# EAGLE design ibr_node (EAGLE 5.11)

## Sheet 1 of 3
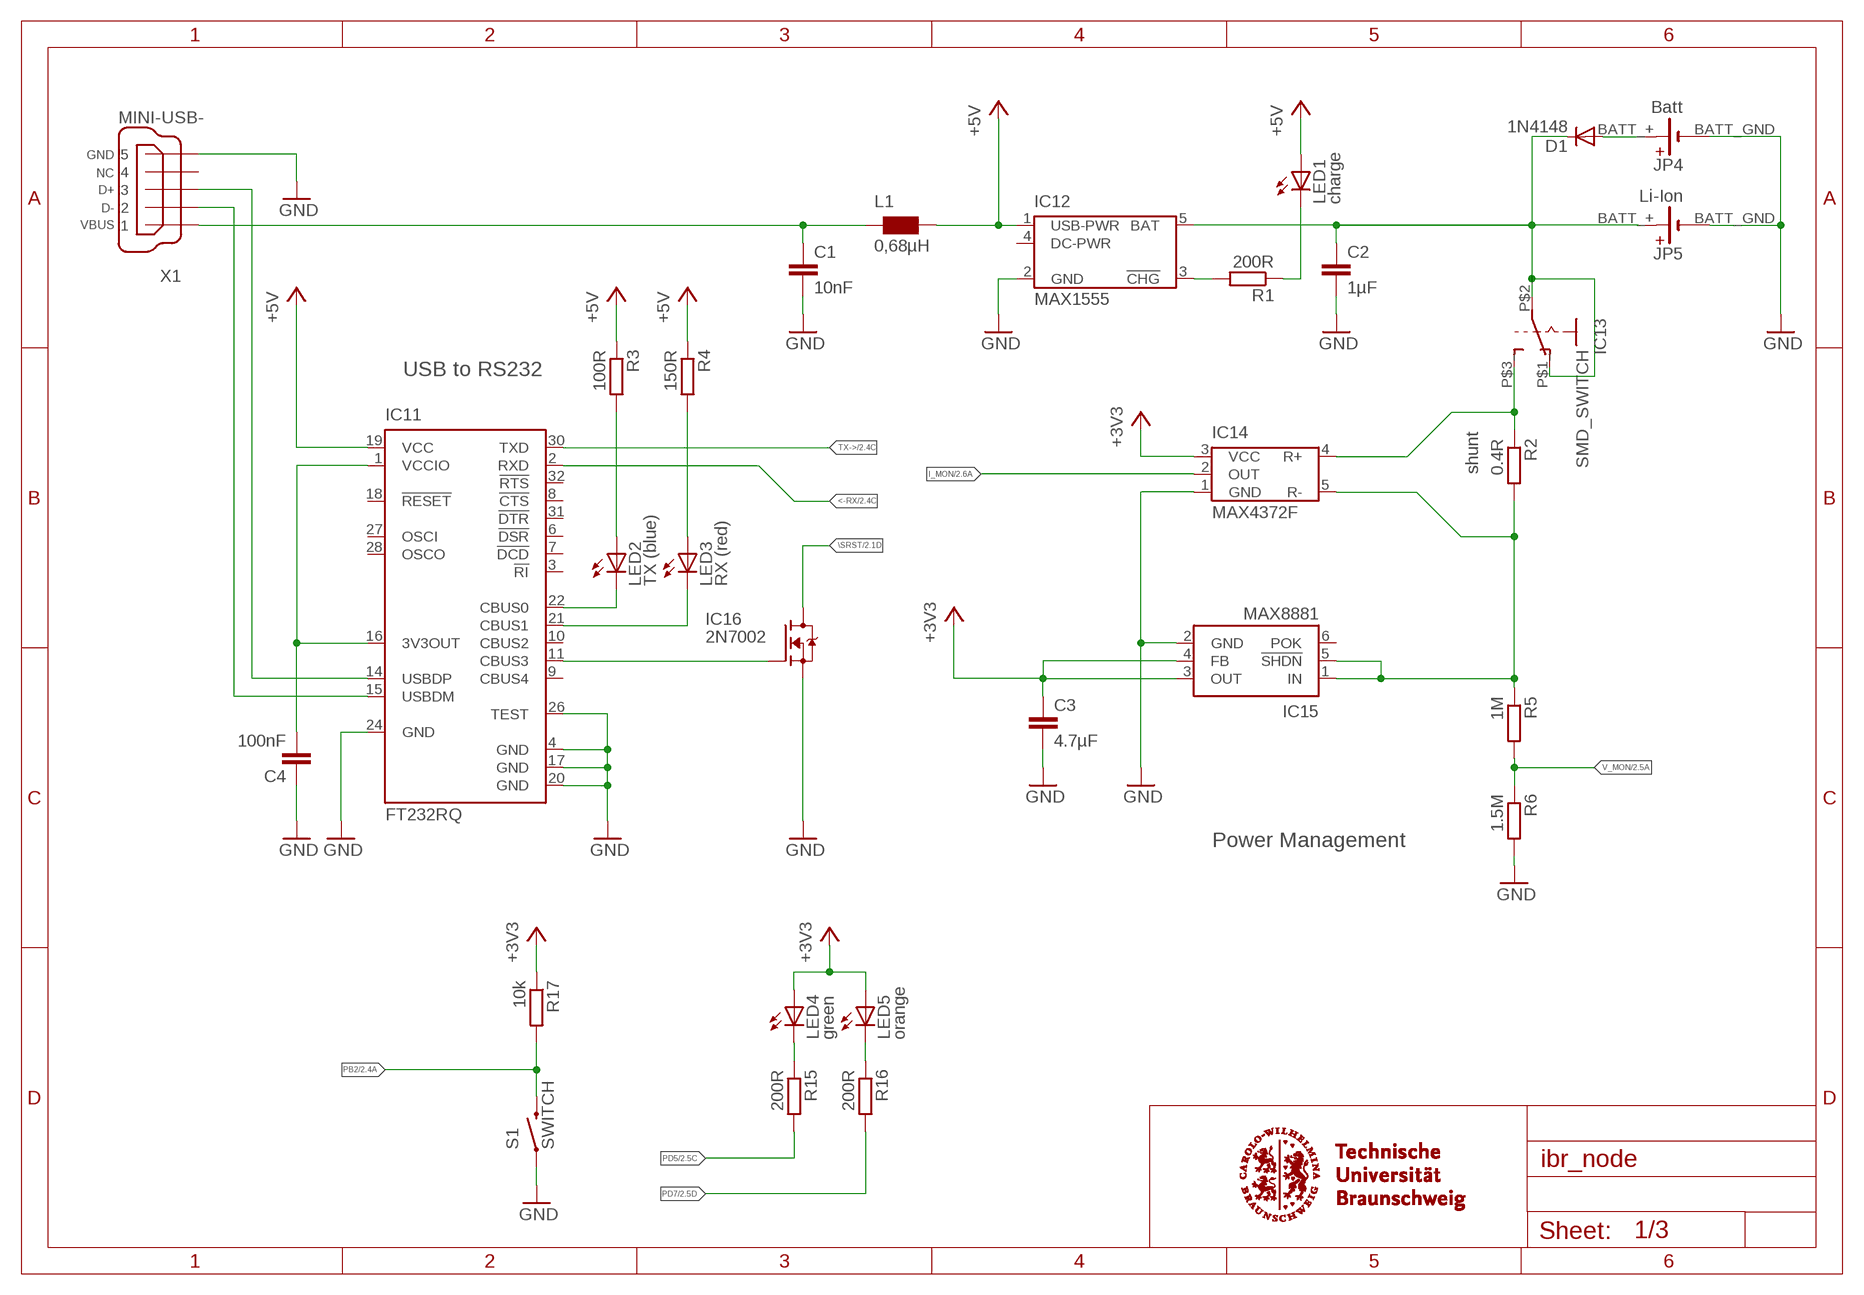
[diagram p0: schematic, sheet 1]

### Parts
C1  10nF  C-EUC0402K  [C0402K]
C2  1µF  C-EUC0402K  [C0402K]
C3  4.7µF  C-EUC0402K  [C0402K]
C4  100nF  C-EUC0402K  [C0402K]
D1  1N4148  DIODESOD  [SOD-323]
IC11  FT232RQ  [QFN32]
IC12  MAX1555  [SOT23-5]
IC13  SMD_SWITCH  [SMD_SWITCH]
IC14  MAX4372F  [SOT23-5]
IC15  MAX8881  [SOT23-6_DBV_R-PDSO-G6]
IC16  2N7002  [SC75_INFINEON]
JP4  Batt  BATT  [BATT]
JP5  Li-Ion  BATT  [BATT]
L1  0,68µH  WE-KIHQ_0805  [WE-KI_0805_B]
LED1  charge  LEDCHIPLED_0805  [CHIPLED_0805]
LED2  TX (blue)  LEDCHIPLED_0805  [CHIPLED_0805]
LED3  RX (red)  LEDCHIPLED_0805  [CHIPLED_0805]
LED4  green  LEDCHIPLED_0805  [CHIPLED_0805]
LED5  orange  LEDCHIPLED_0805  [CHIPLED_0805]
R1  200R  R-EU_R0402  [R0402]
R2  0.4R  R-EU_R0402  [R0402]
R3  100R  R-EU_R0402  [R0402]
R4  150R  R-EU_R0402  [R0402]
R5  1M  R-EU_R0402  [R0402]
R6  1.5M  R-EU_R0402  [R0402]
R15  200R  R-EU_R0402  [R0402]
R16  200R  R-EU_R0402  [R0402]
R17  10k  R-EU_R0402  [R0402]
S1  SWITCH  SWITCH-MOMENTARY-2SMD  [TACTILE_SWITCH_SMD]
X1  MINI-USB-  [UX60-MB-5ST]

### Nets
+3V3: C3.1 IC14.3(VCC) IC15.3(OUT) IC15.4(FB) LED4.A LED5.A R17.1 ; also sheet 2,3
+5V: IC11.19(VCC) IC12.1(USB-PWR) L1.1 LED1.A R3.1 R4.1 ; also sheet 3
<-RX: IC11.2(RXD) ; also sheet 2,3
\SRST: IC16.3(D) ; also sheet 2
BAT: C2.1 D1.1(C) IC12.5(BAT) IC13.P$1_ IC13.P$2_(P1) JP5.BATT_+(+)
BAT_D: D1.2(A) JP4.BATT_+(+)
BAT_PWR: IC13.P$3_(S3) IC14.4(R+) R2.1
CHARGE: IC12.3(!CHG) R1.2
FTDI_INTERNAL: C4.2 IC11.1(VCCIO) IC11.16(3V3OUT)
FTDI_LED_RX: IC11.21(CBUS1) LED3.C
FTDI_LED_TX: IC11.22(CBUS0) LED2.C
FTDI_RESET: IC11.11(CBUS3) IC16.1(G)
GND: C1.2 C2.2 C3.2 C4.1 IC11.4(GND) IC11.17(GND) IC11.20(GND) IC11.24(GND) IC11.26(TEST) IC12.2(GND) IC14.1(GND) IC15.2(GND) IC16.2(S) JP4.BATT_GND(-) JP5.BATT_GND(-) R6.2 S1.1 X1.5 ; also sheet 2,3
I_MON: IC14.2(OUT) ; also sheet 2
LED_CHARGE: LED1.C R1.1
LED_RX: LED3.A R4.2
LED_TX: LED2.A R3.2
PB2: R17.2 S1.3 ; also sheet 2
PD5: R15.2 ; also sheet 2
PD7: R16.2 ; also sheet 2
PWR_MON: IC14.5(R-) IC15.1(IN) IC15.5(!SHDN) R2.2 R5.1
TX->: IC11.30(TXD) ; also sheet 2,3
USBDM: IC11.15(USBDM) X1.2
USBDP: IC11.14(USBDP) X1.3
USBPWR: C1.1 L1.2 X1.1
USER_LED2: LED5.C R16.1
USER_LED_1: LED4.C R15.1
V_MON: R5.2 R6.1 ; also sheet 2
Unconnected: IC11.3(!RI) IC11.6(!DSR) IC11.7(!DCD) IC11.8(!CTS) IC11.9(CBUS4) IC11.10(CBUS2) IC11.18(!RESET) IC11.27(OSCI) IC11.28(OSCO) IC11.31(!DTR) IC11.32(!RTS) IC12.4(DC-PWR) IC15.6(POK) X1.4

### Notes on the sheet
- USB to RS232
- shunt
- Power Management

## Sheet 2 of 3
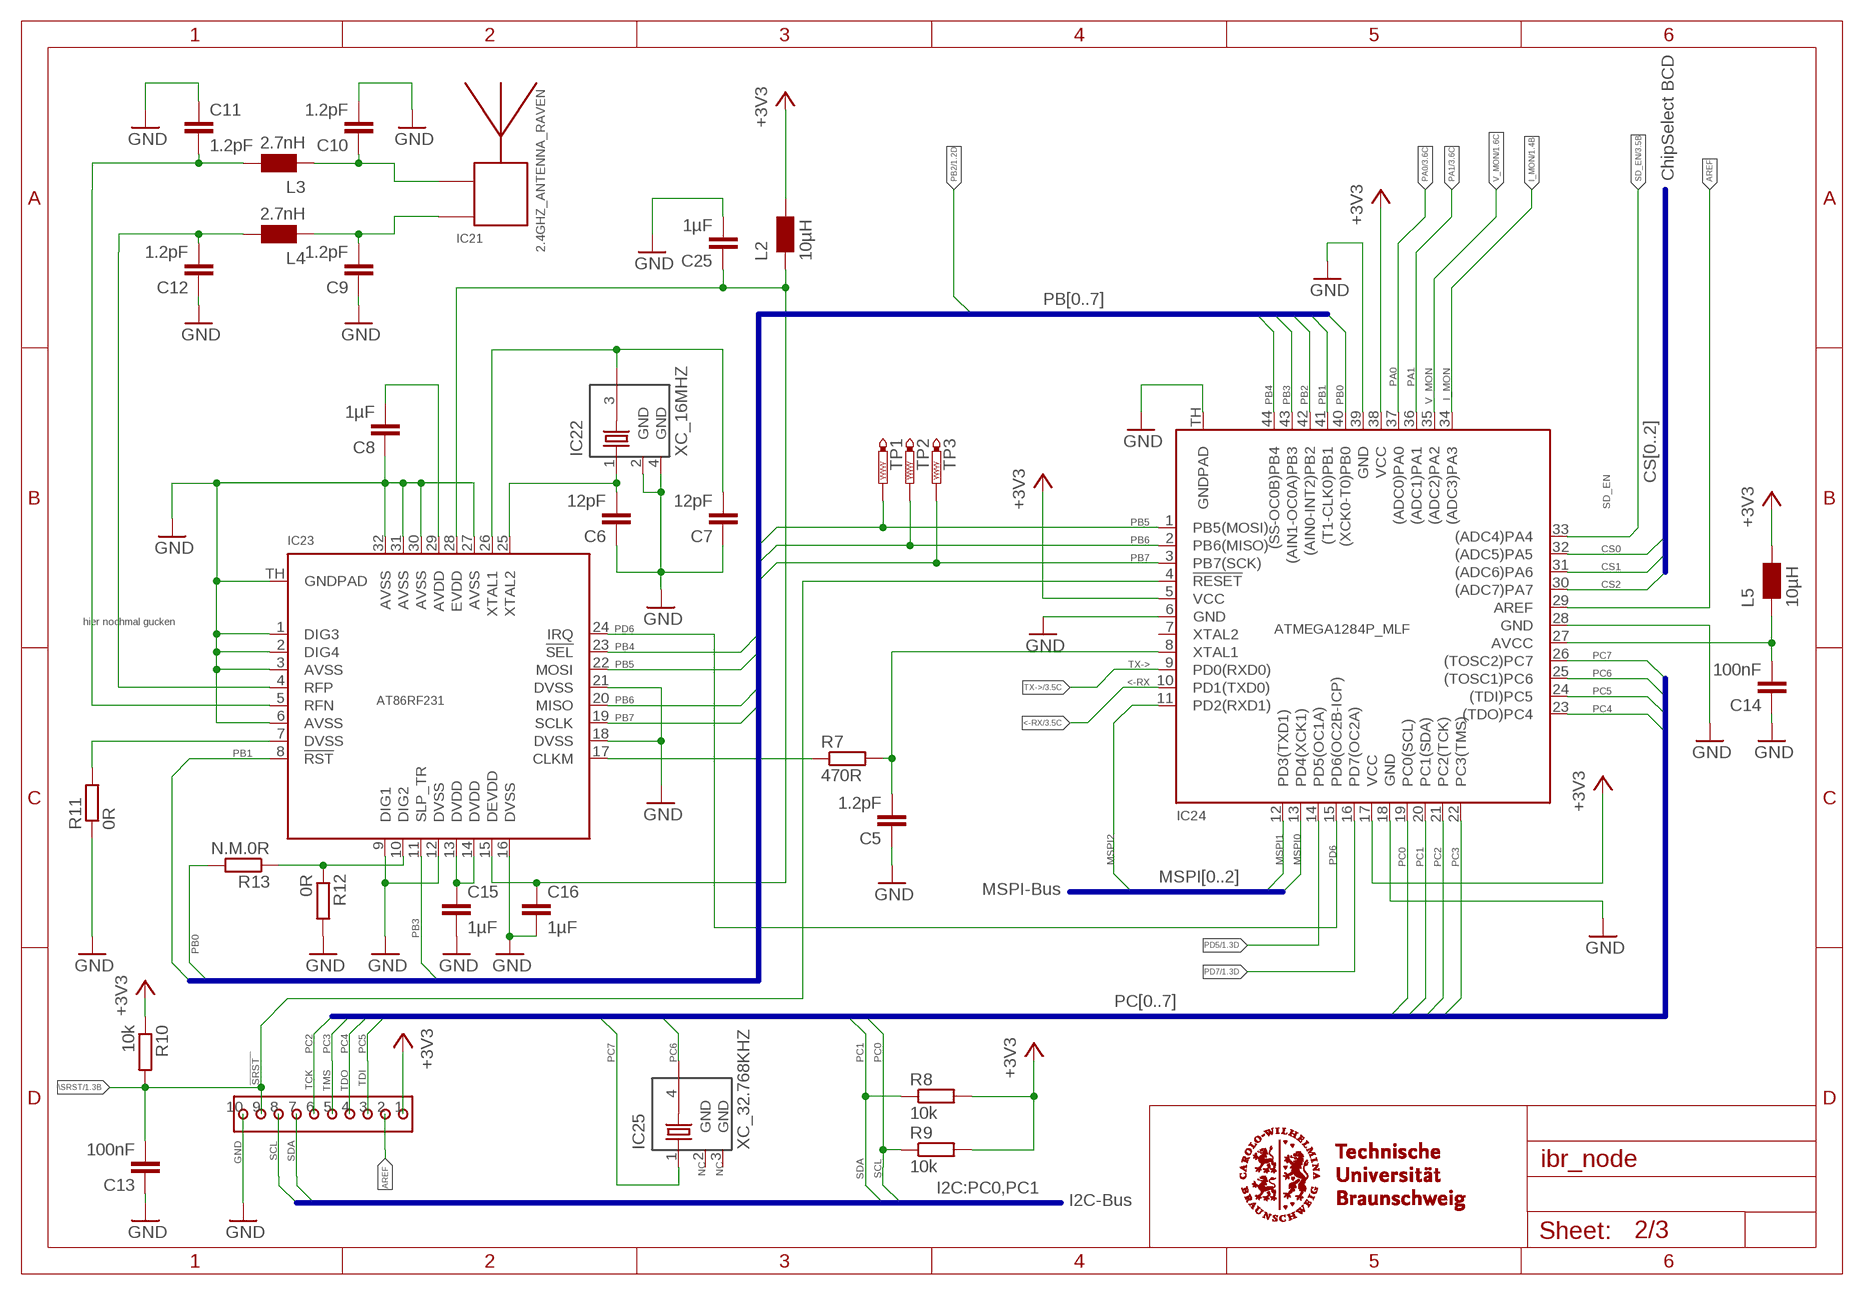
[diagram p1: schematic, sheet 2]

### Parts
C5  1.2pF  C-EUC0402K  [C0402K]
C6  12pF  C-EUC0402K  [C0402K]
C7  12pF  C-EUC0402K  [C0402K]
C8  1µF  C-EUC0402K  [C0402K]
C9  1.2pF  C-EUC0402K  [C0402K]
C10  1.2pF  C-EUC0402K  [C0402K]
C11  1.2pF  C-EUC0402K  [C0402K]
C12  1.2pF  C-EUC0402K  [C0402K]
C13  100nF  C-EUC0402K  [C0402K]
C14  100nF  C-EUC0402K  [C0402K]
C15  1µF  C-EUC0402K  [C0402K]
C16  1µF  C-EUC0402K  [C0402K]
C25  1µF  C-EUC0402K  [C0402K]
IC21  2.4GHZ_ANTENNA_RAVEN  [2.4GHZ_PCB_ANTENNA_2]
IC22  XC_16MHZ  [CX2520SB_2.0X2.5]
IC23  AT86RF231  [MLF32-TH]
IC24  ATMEGA1284P_MLF  [MLF44-TH]
IC25  XC_32.768KHZ  [85SMX]
JP3  CON_1.27  [1X10]
L2  10µH  WE-KIHQ_0805  [WE-KI_0805_B]
L3  2.7nH  WE-KIHQ_0402  [0402]
L4  2.7nH  WE-KIHQ_0402  [0402]
L5  10µH  WE-KIHQ_0805  [WE-KI_0805_B]
R7  470R  R-EU_R0402  [R0402]
R8  10k  R-EU_R0402  [R0402]
R9  10k  R-EU_R0402  [R0402]
R10  10k  R-EU_R0402  [R0402]
R11  0R  R-EU_R0402  [R0402]
R12  0R  R-EU_R0402  [R0402]
R13  N.M.0R  R-EU_R0402  [R0402]
TP1  PTR1TP06R  [TP06R]
TP2  PTR1TP06R  [TP06R]
TP3  PTR1TP06R  [TP06R]

### Nets
+3V3: IC24.5(VCC) IC24.17(VCC) IC24.38(VCC) JP3.1 L2.1 L5.1 R8.2 R9.2 R10.1 ; also sheet 1,3
<-RX: IC24.10(PD1(TXD0)) ; also sheet 1,3
\SRST: C13.2 IC24.4(!RESET) JP3.9 R10.2 ; also sheet 1
AREF: IC24.29(AREF) JP3.2
AVCC: C14.2 IC24.27(AVCC) L5.2
AVDD: C8.2 IC23.29(AVDD)
CLKM: IC23.17(CLKM) R7.1
CS0: IC24.32((ADC5)PA5) ; also sheet 3
CS1: IC24.31((ADC6)PA6) ; also sheet 3
CS2: IC24.30((ADC7)PA7) ; also sheet 3
DEVDD: C16.1 C25.1 IC23.15(DEVDD) IC23.28(EVDD) L2.2
DIG2: IC23.10(DIG2) R12.1 R13.1
DVDD: C15.1 IC23.13(DVDD) IC23.14(DVDD)
DVSS: IC23.7(DVSS) R11.2
GND: C5.1 C6.1 C7.1 C8.1 C9.1 C10.2 C11.1 C12.1 C13.1 C14.1 C15.2 C16.2 C25.2 IC22.2(GND) IC22.4(GND) IC23.1(DIG3) IC23.2(DIG4) IC23.3(AVSS) IC23.6(AVSS) IC23.9(DIG1) IC23.12(DVSS) IC23.16(DVSS) IC23.18(DVSS) IC23.21(DVSS) IC23.27(AVSS) IC23.30(AVSS) IC23.31(AVSS) IC23.32(AVSS) IC23.TH(GNDPAD) IC24.6(GND) IC24.18(GND) IC24.28(GND) IC24.39(GND) IC24.TH(GNDPAD) JP3.10 R11.1 R12.2 ; also sheet 1,3
I_MON: IC24.34((ADC3)PA3) ; also sheet 1
MSPI0: IC24.13(PD4(XCK1)) ; also sheet 3
MSPI1: IC24.12(PD3(TXD1)) ; also sheet 3
MSPI2: IC24.11(PD2(RXD1)) ; also sheet 3
PA0: IC24.37((ADC0)PA0) ; also sheet 3
PA1: IC24.36((ADC1)PA1) ; also sheet 3
PB0: IC24.40((XCK0-T0)PB0) R13.2
PB1: IC23.8(!RST) IC24.41((T1-CLK0)PB1)
PB2: IC24.42((AIN0-INT2)PB2) ; also sheet 1
PB3: IC23.11(SLP_TR) IC24.43((AIN1-OC0A)PB3)
PB4: IC23.23(!SEL) IC24.44((SS-OC0B)PB4)
PB5: IC23.22(MOSI) IC24.1(PB5(MOSI)) TP1.TP
PB6: IC23.20(MISO) IC24.2(PB6(MISO)) TP2.TP
PB7: IC23.19(SCLK) IC24.3(PB7(SCK)) TP3.TP
PC0: IC24.19(PC0(SCL)) JP3.8 R9.1 ; also sheet 3
PC1: IC24.20(PC1(SDA)) JP3.7 R8.1 ; also sheet 3
PC2: IC24.21(PC2(TCK)) JP3.6
PC3: IC24.22(PC3(TMS)) JP3.5
PC4: IC24.23((TDO)PC4) JP3.4
PC5: IC24.24((TDI)PC5) JP3.3
PC6: IC24.25((TOSC1)PC6) IC25.4
PC7: IC24.26((TOSC2)PC7) IC25.1
PD5: IC24.14(PD5(OC1A)) ; also sheet 1
PD6: IC23.24(IRQ) IC24.15(PD6(OC2B-ICP))
PD7: IC24.16(PD7(OC2A)) ; also sheet 1
RF_XTAL1: C7.2 IC22.3 IC23.26(XTAL1)
RF_XTAL2: C6.2 IC22.1 IC23.25(XTAL2)
RFM: C11.2 IC23.5(RFN) L3.1
RFM_ANT: C10.1 IC21.RF_A L3.2
RFP: C12.2 IC23.4(RFP) L4.1
RFP_ANT: C9.2 IC21.RF_B L4.2
SD_EN: IC24.33((ADC4)PA4) ; also sheet 3
TX->: IC24.9(PD0(RXD0)) ; also sheet 1,3
V_MON: IC24.35((ADC2)PA2) ; also sheet 1
XTAL1: C5.2 IC24.8(XTAL1) R7.2
Unconnected: IC24.7(XTAL2) IC25.2(GND) IC25.3(GND)

### Buses
MSPI[0..2]
PB[0..7]
CS[0..2]
PC[0..7]
I2C:PC0,PC1

### Notes on the sheet
- ChipSelect BCD
- hier nochmal gucken
- MSPI-Bus
- !SRST
- TCK | TMS | TDO | TDI
- GND | SCL | SDA
- SDA | SCL
- NC | NC
- I2C-Bus

## Sheet 3 of 3
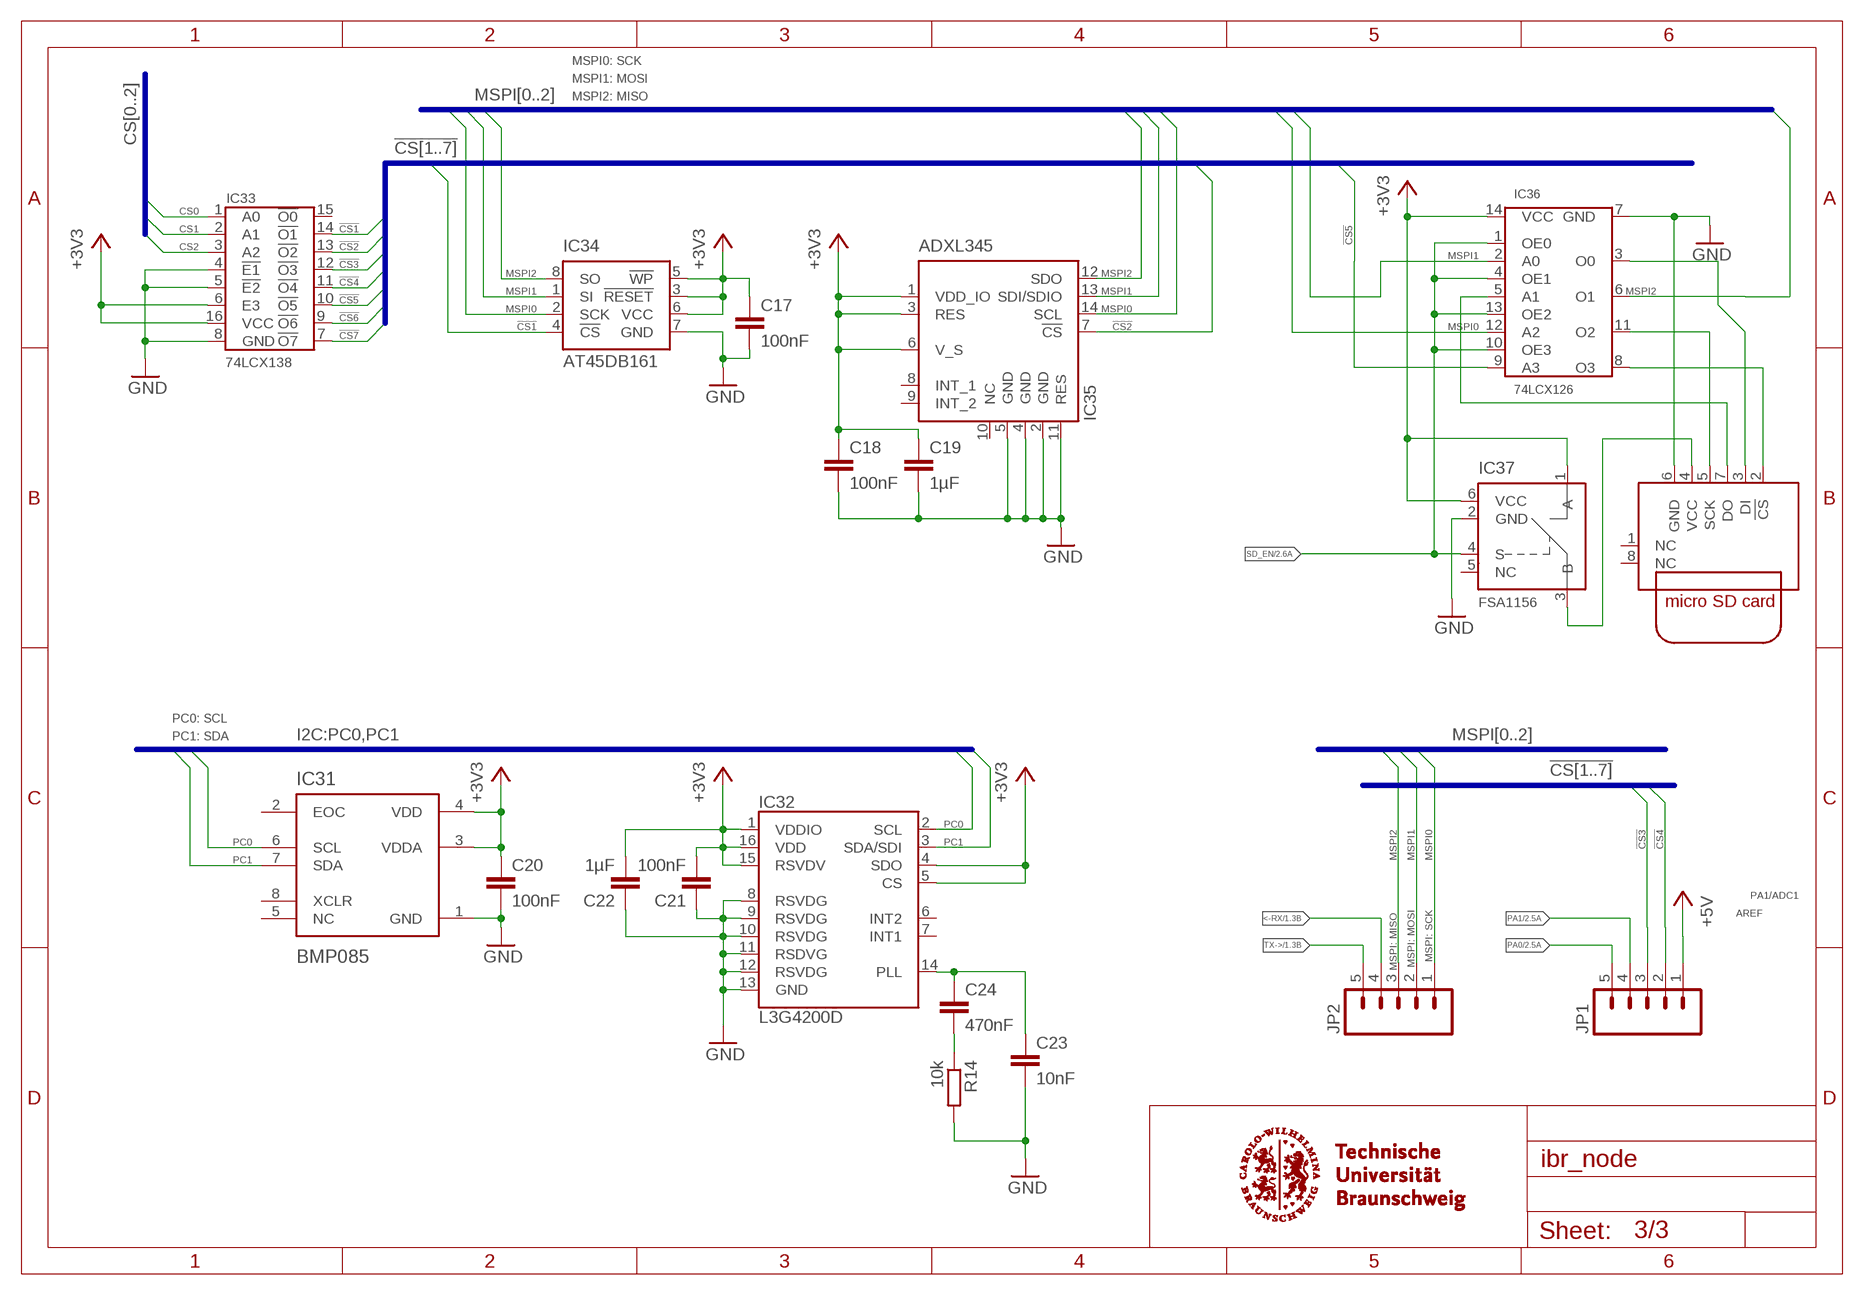
[diagram p2: schematic, sheet 3]

### Parts
C17  100nF  C-EUC0402K  [C0402K]
C18  100nF  C-EUC0402K  [C0402K]
C19  1µF  C-EUC0402K  [C0402K]
C20  100nF  C-EUC0402K  [C0402K]
C21  100nF  C-EUC0402K  [C0402K]
C22  1µF  C-EUC0402K  [C0402K]
C23  10nF  C-EUC0402K  [C0402K]
C24  470nF  C-EUC0402K  [C0402K]
IC31  BMP085  [QFN127P500X500X120-8N]
IC32  L3G4200D  [LGA16-4X4]
IC33  74LCX138  [DQFN16_2.5X3.5]
IC34  AT45DB161  AT86DB161  [DFN-S]
IC35  ADXL345  [LGA14_3X5X1]
IC36  74LCX126  [DQFN14_2.5X3]
IC37  FSA1156  [SC70-6L]
JP1  M05PTH  [1X05]
JP2  M05PTH  [1X05]
R14  10k  R-EU_R0402  [R0402]
X2  MICRO-SD_MOLEX  [MICRO_SD_MOLEX]

### Nets
!CS1: IC33.14(!O1) IC34.4(!CS)
!CS2: IC33.13(!O2) IC35.7(!CS)
!CS3: IC33.12(!O3) JP1.3
!CS4: IC33.11(!O4) JP1.2
!CS5: IC33.10(!O5) IC36.9(A3)
!CS6: IC33.9(!O6)
!CS7: IC33.7(!O7)
+3V3: C17.1 C18.1 C19.1 C20.1 C21.2 C22.2 IC31.3(VDDA) IC31.4(VDD) IC32.1(VDDIO) IC32.4(SDO) IC32.5(CS) IC32.15(RSVDV) IC32.16(VDD) IC33.6(E3) IC33.16(VCC) IC34.3(!RESET) IC34.5(!WP) IC34.6(VCC) IC35.1(VDD_IO) IC35.3(RES) IC35.6(V_S) IC36.14(VCC) IC37.1(A) IC37.6(VCC) ; also sheet 1,2
+5V: JP1.1 ; also sheet 1
<-RX: JP2.4 ; also sheet 1,2
CS0: IC33.1(A0) ; also sheet 2
CS1: IC33.2(A1) ; also sheet 2
CS2: IC33.3(A2) ; also sheet 2
CS_SD: IC36.8(O3) X2.2(!CS)
GND: C17.2 C18.2 C19.2 C20.2 C21.1 C22.1 C23.2 IC31.1(GND) IC32.8(RSVDG) IC32.9(RSVDG) IC32.10(RSVDG) IC32.11(RSDVG) IC32.12(RSVDG) IC32.13(GND) IC33.4(!E1) IC33.5(!E2) IC33.8(GND) IC34.7(GND) IC35.2(GND) IC35.4(GND) IC35.5(GND) IC35.11(RES) IC36.7(GND) IC37.2(GND) R14.2 X2.6(GND) ; also sheet 1,2
MSPI0: IC34.2(SCK) IC35.14(SCL) IC36.12(A2) JP2.1 ; also sheet 2
MSPI0_SD: IC36.11(O2) X2.5(SCK)
MSPI1: IC34.1(SI) IC35.13(SDI/SDIO) IC36.2(A0) JP2.2 ; also sheet 2
MSPI1_SD: IC36.3(O0) X2.3(DI)
MSPI2: IC34.8(SO) IC35.12(SDO) IC36.6(O1) JP2.3 ; also sheet 2
MSPI2_SD: IC36.5(A1) X2.7(DO)
PA0: JP1.5 ; also sheet 2
PA1: JP1.4 ; also sheet 2
PC0: IC31.6(SCL) IC32.2(SCL) ; also sheet 2
PC1: IC31.7(SDA) IC32.3(SDA/SDI) ; also sheet 2
PLL: C23.1 C24.1 IC32.14(PLL)
PLL_GND: C24.2 R14.1
SD_EN: IC36.1(OE0) IC36.4(OE1) IC36.10(OE3) IC36.13(OE2) IC37.4(S) ; also sheet 2
SD_PWR: IC37.3(B) X2.4(VCC)
TX->: JP2.5 ; also sheet 1,2
Unconnected: IC31.2(EOC) IC31.5(NC) IC31.8(XCLR) IC32.6(INT2) IC32.7(INT1) IC33.15(!O0) IC35.8(INT_1) IC35.9(INT_2) IC35.10(NC) IC37.5(NC) X2.1(NC) X2.8(NC)

### Buses
MSPI[0..2]
CS[0..2]
!CS[1..7]
I2C:PC0,PC1

### Notes on the sheet
- MSPI0: SCK
- MSPI1: MOSI
- MSPI2: MISO
- PC0: SCL
- PC1: SDA
- PA1/ADC1
- MSPI: MISO | MSPI: MOSI | MSPI: SCK | AREF

## Library data of the parts
C1 C4-C25 = ibr_node:C-EU: CAPACITOR, European symbol
C2 C3 = rcl:C-EU: CAPACITOR, European symbol
D1 = SparkFun:DIODE: Diode These are standard reverse protection diodes and small signal diodes. SMA package can handle up to about 1A. SOD-323 can handle about 200mA. What the SOD-323 package when ordering, there are some mfgs out there that are 5-pin packages.
IC11 = ibr_node:FT232R: Source: http://www.ftdichip.com/Documents/DataSheets/DS_FT232R_v104.pdf
IC12 = ibr_node:MAX1555
IC13 = ibr_node:SMD_SWITCH
IC14 = ibr_node:MAX4372F
IC15 = ibr_node:MAX8881
IC16 = ibr_node:2N7002
IC21 = ibr_node:2.4GHZ_ANTENNA_RAVEN
IC22 = ibr_node:XC_16MHZ
IC23 = ibr_node:AT86RF231
IC24 = ibr_node:ATMEGA1284P_MLF
IC25 = ibr_node:XC_32.768KHZ
IC31 = ibr_node:BMP085: BMP085 Digital pressure sensor
IC32 = ibr_node:L3G4200D: L3G4200D Three-axis, digital output gyroscope The L3G4200D is a low-power three-axis angular rate sensor, has a full scale of ±250/±500/±2000 dps and is capable of measuring rates with a user-selectable bandwidth. It includes a sensing element and an IC interface capable of providing the measured angular rate to the external world through a digital interface (I2C/SPI). Package: 4x4x1.1 LGA-16 (LGA16-4x4.PAC)
IC33 = ibr_node:74LCX138
IC34 = ibr_node:AT86DB161
IC35 = ibr_node:ADXL345
IC36 = ibr_node:74LCX126
IC37 = ibr_node:FSA1156
JP1 JP2 = SparkFun:M05: Header 5 Standard 5-pin 0.1" header. Use with straight break away headers (SKU : PRT-00116), right angle break away headers (PRT-00553), swiss pins (PRT-00743), machine pins (PRT-00117), and female headers (PRT-00115). Molex polarized connector foot print use with SKU : PRT-08230 with associated crimp pins and housings.
JP3 = ibr_node:CON_1.27
JP4 JP5 = ibr_node:BATT
L1-L5 = wuerth-elektronik:WE-KIHQ: SMD Wire Wound Ceramic Inductor WE-KIHQ - High current - Highest Quality factor in size 0805 - up to 98 - High thermal stability - High SRF -- Bluetooth -- Wireless LAN -- RF oscillation circuit -- IF impedance matching -- IG choke
LED1-LED5 = led:LED: LED OSRAM: - CHIPLED LG R971, LG N971, LY N971, LG Q971, LY Q971, LO R971, LY R971 LH N974, LH R974 LS Q976, LO Q976, LY Q976 LO Q996 - Hyper CHIPLED LW Q18S LB Q993, LB Q99A, LB R99A - SideLED LS A670, LO A670, LY A670, LG A670, LP A670 LB A673, LV A673, LT A673, LW A673 LH A674 LY A675 LS A676, LA A676, LO A676, LY A676, LW A676 LS A679, LY A679, LG A679 - Hyper Micro SIDELED® LS Y876, LA Y876, LO Y876, LY Y876 LT Y87S - SmartLED LW L88C, LW L88S LB L89C, LB L89S, LG L890 LS L89K, LO L89K, LY L89K LS L896, LA L896, LO L896, LY L896 - TOPLED LS T670, LO T670, LY T670, LG T670, LP T670 LSG T670, LSP T670, LSY T670, LOP T670, LYG T670 LG T671, LOG T671, LSG T671 LB T673, LV T673, LT T673, LW T673 LH T674 LS T676, LA T676, LO T676, LY T676, LB T676, LH T676, LSB T676, LW T676 LB T67C, LV T67C, LT T67C, LS T67K, LO T67K, LY T67K, LW E67C LS E67B, LA E67B, LO E67B, LY E67B, LB E67C, LV E67C, LT E67C LW T67C LS T679, LY T679, LG T679 LS T770, LO T770, LY T770, LG T770, LP T770 LB T773, LV T773, LT T773, LW T773 LH T774 LS E675, LA E675, LY E675, LS T675 LS T776, LA T776, LO T776, LY T776, LB T776 LHGB T686 LT T68C, LB T68C - Hyper Mini TOPLED® LB M676 - Mini TOPLED Santana® LG M470 LS M47K, LO M47K, LY M47K Source: http://www.osram.convergy.de LUXEON: - LUMILED® LXK2-PW12-R00, LXK2-PW12-S00, LXK2-PW14-U00, LXK2-PW14-V00 LXK2-PM12-R00, LXK2-PM12-S00, LXK2-PM14-U00 LXK2-PE12-Q00, LXK2-PE12-R00, LXK2-PE12-S00, LXK2-PE14-T00, LXK2-PE14-U00 LXK2-PB12-K00, LXK2-PB12-L00, LXK2-PB12-M00, LXK2-PB14-N00, LXK2-PB14-P00, LXK2-PB14-Q00 LXK2-PR12-L00, LXK2-PR12-M00, LXK2-PR14-Q00, LXK2-PR14-R00 LXK2-PD12-Q00, LXK2-PD12-R00, LXK2-PD12-S00 LXK2-PH12-R00, LXK2-PH12-S00 LXK2-PL12-P00, LXK2-PL12-Q00, LXK2-PL12-R00 Source: www.luxeon.com KINGBRIGHT: KA-3528ASYC Source: www.kingbright.com
R1-R17 = rcl:R-EU_: RESISTOR, European symbol
S1 = ibr_node:SWITCH-MOMENTARY-2
TP1-TP3 = testpad:PTR1: TEST PIN
X1 = ibr_node:MINI-USB-: MINI USB Connector Source: http://www.hirose.co.jp/cataloge_hp/e24000019.pdf
X2 = ibr_node:MICRO-SD_MOLEX

## Board
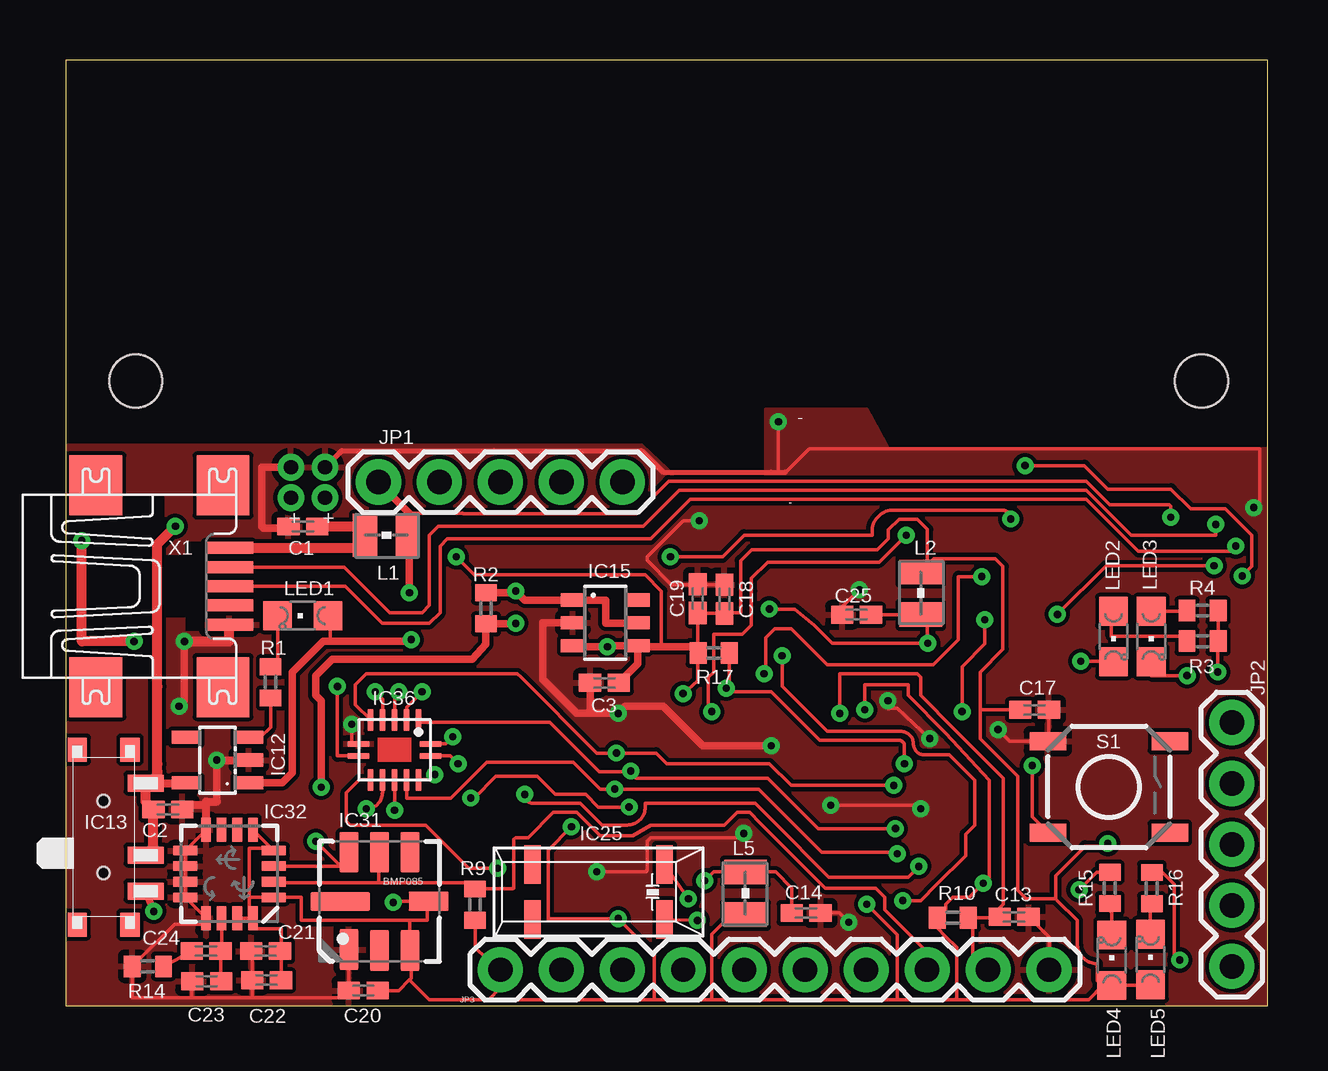
[diagram p3: board, top side]
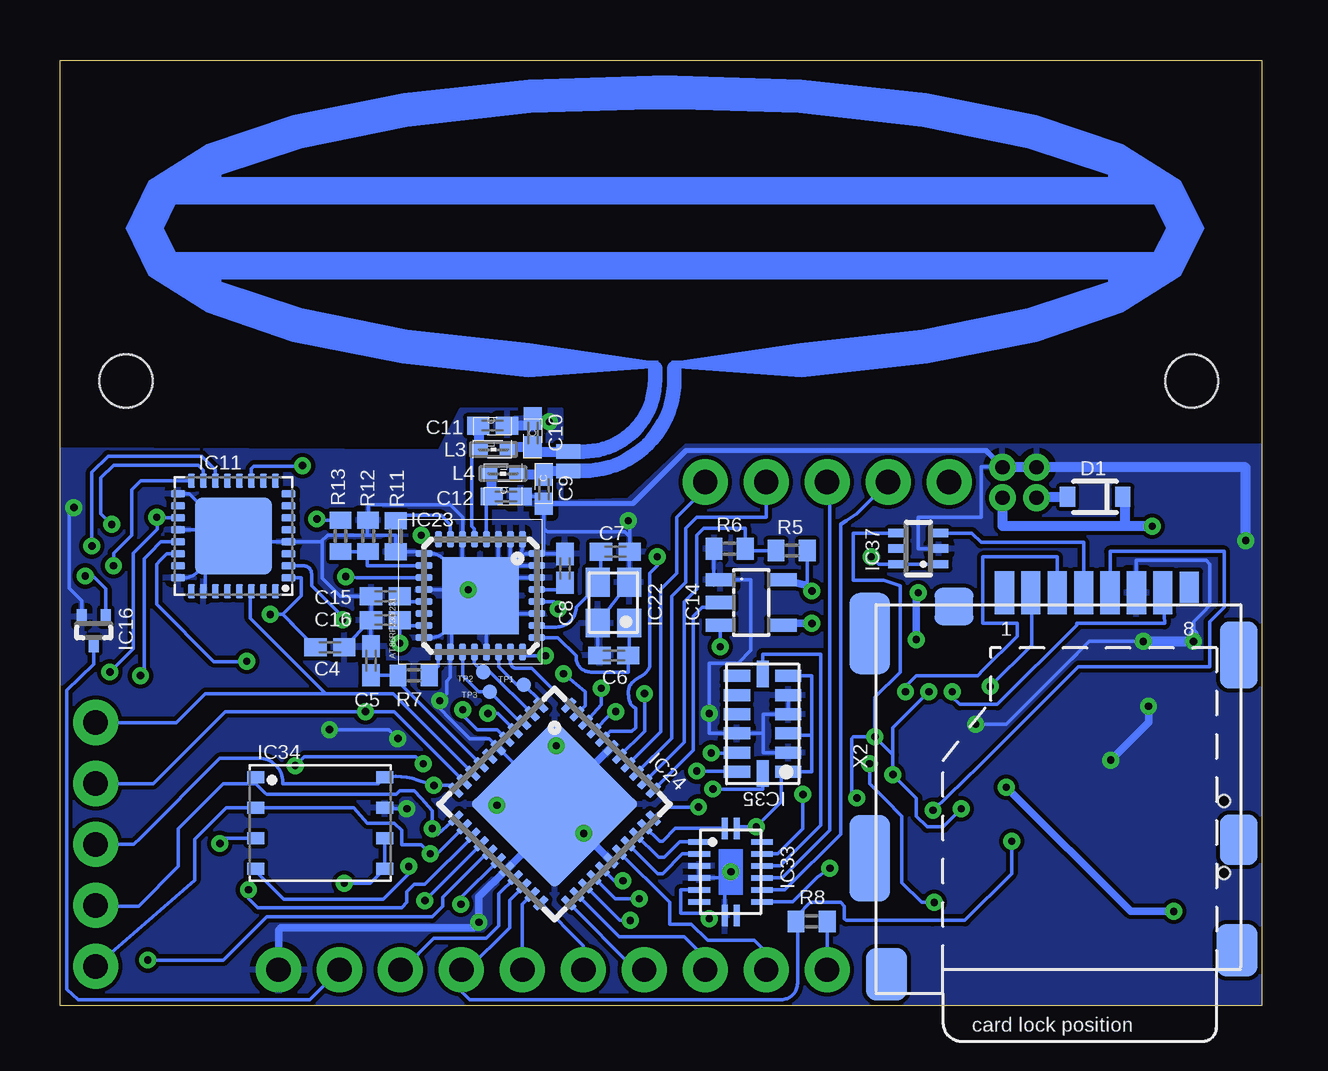
[diagram p4: board, bottom side, seen from below]

Size 50.08 x 39.4 mm. Coordinates in mm from the lower left corner, seen from the top.
Outline: 0,39.4 0,0 50.08,0 50.08,39.4 0,39.4
Copper layers (1*16): Top 0.035mm / dielectric 1.5mm / Bottom 0.035mm
Design rules "default *": minimum track width 0.15mm, minimum drill 0.3mm, track to track 0.17mm, track to pad 0.17mm, pad to pad 0.17mm, via to via 0.17mm, smd to smd 0.17mm, copper to edge 1mil, drill to drill 0.17mm, minimum pad ring 10mil, minimum via ring 8mil, stop-mask expansion 4mil, vias tented up to drill 0.32mm, thermal gap 10mil
Holes 2.2 mm at 2.93,26.02 47.33,26.02

### Footprints (pad centres in the part's own frame; a part is rotated, then mirrored left to right if it is on the bottom)
C0402K = smd 0.925 x 0.74: 1 -0.6,0; 2 0.6,0
SOD-323 = smd 0.63 x 0.83: 1 -1.15,0; 2 1.15,0
QFN32 = smd 0.6 x 0.3: 1 -2.3,1.75; 2 -2.3,1.25; 3 -2.3,0.75; 4 -2.3,0.25; 5 -2.3,-0.25; 6 -2.3,-0.75; 7 -2.3,-1.25; 8 -2.3,-1.75; 17 2.3,-1.75; 18 2.3,-1.25; 19 2.3,-0.75; 20 2.3,-0.25; 21 2.3,0.25; 22 2.3,0.75; 23 2.3,1.25; 24 2.3,1.75 | smd 0.3 x 0.6: 9 -1.75,-2.3; 10 -1.25,-2.3; 11 -0.75,-2.3; 12 -0.25,-2.3; 13 0.25,-2.3; 14 0.75,-2.3; 15 1.25,-2.3; 16 1.75,-2.3; 25 1.75,2.3; 26 1.25,2.3; 27 0.75,2.3; 28 0.25,2.3; 29 -0.25,2.3; 30 -0.75,2.3; 31 -1.25,2.3; 32 -1.75,2.3 | smd 3.2 x 3.2: EXP 0,0
SOT23-5 = smd 0.55 x 1.2: 1 -0.95,-1.3; 2 0,-1.3; 3 0.95,-1.3; 4 0.95,1.3; 5 -0.95,1.3
SMD_SWITCH = smd 0.7 x 1.5: P$1_ 4.9,3.25; P$2_ 1.9,3.25; P$3_ 6.4,3.25 | smd 1 x 0.8: P$4 0.5,0.4; P$5 0.5,2.6; P$6 7.8,2.6; P$7 7.8,0.4 | hole 0.5: 2.65,1.5; 5.65,1.5
SOT23-6_DBV_R-PDSO-G6 = smd 0.55 x 1: 1 -0.95,-1.35; 2 0,-1.35; 3 0.95,-1.35; 4 0.95,1.35; 5 0,1.35; 6 -0.95,1.35
SC75_INFINEON = smd 0.4 x 0.65: 1 -0.5,-0.575; 2 0.5,-0.575; 3 0,0.575
2.4GHZ_PCB_ANTENNA_2 = smd 0.6 x 1: RF_A 9.32,19.23; RF_B 10.12,19.225
CX2520SB_2.0X2.5 = smd 1.2 x 1: 1 -0.85,-0.65; 2 0.85,-0.65; 3 0.85,0.65; 4 -0.85,0.65
MLF32-TH = smd 0.7 x 0.3: 1 -2.35,1.75; 2 -2.35,1.25; 3 -2.35,0.75; 4 -2.35,0.25; 5 -2.35,-0.25; 6 -2.35,-0.75; 7 -2.35,-1.25; 8 -2.35,-1.75; 17 2.35,-1.75; 18 2.35,-1.25; 19 2.35,-0.75; 20 2.35,-0.25; 21 2.35,0.25; 22 2.35,0.75; 23 2.35,1.25; 24 2.35,1.75 | smd 0.3 x 0.7: 9 -1.75,-2.35; 10 -1.25,-2.35; 11 -0.75,-2.35; 12 -0.25,-2.35; 13 0.25,-2.35; 14 0.75,-2.35; 15 1.25,-2.35; 16 1.75,-2.35; 25 1.75,2.35; 26 1.25,2.35; 27 0.75,2.35; 28 0.25,2.35; 29 -0.25,2.35; 30 -0.75,2.35; 31 -1.25,2.35; 32 -1.75,2.35 | smd 3.2 x 3.2: TH 0,0
MLF44-TH = smd 0.7 x 0.3: 1 -3.325,2.5; 2 -3.325,2; 3 -3.325,1.5; 4 -3.325,1; 5 -3.325,0.5; 6 -3.325,0; 7 -3.325,-0.5; 8 -3.325,-1; 9 -3.325,-1.5; 10 -3.325,-2; 11 -3.325,-2.5; 23 3.325,-2.5; 24 3.325,-2; 25 3.325,-1.5; 26 3.325,-1; 27 3.325,-0.5; 28 3.325,0; 29 3.325,0.5; 30 3.325,1; 31 3.325,1.5; 32 3.325,2; 33 3.325,2.5 | smd 0.3 x 0.7: 12 -2.5,-3.325; 13 -2,-3.325; 14 -1.5,-3.325; 15 -1,-3.325; 16 -0.5,-3.325; 17 0,-3.325; 18 0.5,-3.325; 19 1,-3.325; 20 1.5,-3.325; 21 2,-3.325; 22 2.5,-3.325; 34 2.5,3.325; 35 2,3.325; 36 1.5,3.325; 37 1,3.325; 38 0.5,3.325; 39 0,3.325; 40 -0.5,3.325; 41 -1,3.325; 42 -1.5,3.325; 43 -2,3.325; 44 -2.5,3.325 | smd 5 x 5: TH 0,0
85SMX = smd 0.7 x 1.6: 1 -2.75,-1.15; 2 2.75,-1.15; 3 2.75,1.15; 4 -2.75,1.15
QFN127P500X500X120-8N = smd 1.67 x 0.8: 1 -2.01,1.27; 2 -2.05,0; 3 -2.05,-1.27; 5 2.05,-1.27; 6 2.05,0; 7 2.05,1.27 | smd 0.8 x 1.67: 4 0,-2.05 | smd 0.8 x 2.5: 8 0,1.63
LGA16-4X4 = smd 1 x 0.4: 1 -1.85,0.975; 2 -1.85,0.325; 3 -1.85,-0.325; 4 -1.85,-0.975; 9 1.85,-0.975; 10 1.85,-0.325; 11 1.85,0.325; 12 1.85,0.975 | smd 0.4 x 1: 5 -0.975,-1.85; 6 -0.325,-1.85; 7 0.325,-1.85; 8 0.975,-1.85; 13 0.975,1.85; 14 0.325,1.85; 15 -0.325,1.85; 16 -0.975,1.85
DQFN16_2.5X3.5 = smd 0.9 x 0.24: 1 -1.81,-0.25; 8 1.81,-0.25; 9 1.81,0.25; 16 -1.81,0.25 | smd 0.24 x 0.9: 2 -1.25,-1.31; 3 -0.75,-1.31; 4 -0.25,-1.31; 5 0.25,-1.31; 6 0.75,-1.31; 7 1.25,-1.31; 10 1.25,1.31; 11 0.75,1.31; 12 0.25,1.31; 13 -0.25,1.31; 14 -0.75,1.31; 15 -1.25,1.31
DFN-S = smd 0.7 x 0.5: 1 -2.69,1.905; 2 -2.69,0.635; 3 -2.69,-0.635; 4 -2.69,-1.905; 5 2.69,-1.905; 6 2.69,-0.635; 7 2.69,0.635; 8 2.69,1.905
LGA14_3X5X1 = smd 1.1 x 0.5: 1 -1.07,2; 2 -1.07,1.2; 3 -1.07,0.4; 4 -1.07,-0.4; 5 -1.07,-1.2; 6 -1.07,-2; 8 1.07,-2; 9 1.07,-1.2; 10 1.07,-0.4; 11 1.07,0.4; 12 1.07,1.2; 13 1.07,2 | smd 0.5 x 1.1: 7 0,-2.07; 14 0,2.07
DQFN14_2.5X3 = smd 0.9 x 0.24: 1 -1.5,-0.25; 7 1.5,-0.25; 8 1.5,0.25; 14 -1.5,0.25 | smd 0.24 x 0.9: 2 -1,-1.25; 3 -0.5,-1.25; 4 0,-1.25; 5 0.5,-1.25; 6 1,-1.25; 9 1,1.25; 10 0.5,1.25; 11 0,1.25; 12 -0.5,1.25; 13 -1,1.25
SC70-6L = smd 0.35 x 0.8: 1 -0.65,-0.85; 2 0,-0.85; 3 0.65,-0.85; 4 0.65,0.85; 5 0,0.85; 6 -0.65,0.85
1X05 = drill 1.016 pad 1.88 round: 1 0,0; 2 2.54,0; 3 5.08,0; 4 7.62,0; 5 10.16,0
1X10 = drill 1.016 pad 1.88 round: 1 0,0; 2 2.54,0; 3 5.08,0; 4 7.62,0; 5 10.16,0; 6 12.7,0; 7 15.24,0; 8 17.78,0; 9 20.32,0; 10 22.86,0
BATT = drill 0.6 pad 1.016 round: BATT_+ 0,0; BATT_GND 1.27,0
WE-KI_0805_B = smd 1.02 x 1.78: 1 -0.89,0; 2 0.89,0
0402 = smd 0.7 x 0.6: 1 -0.6,0; 2 0.6,0
CHIPLED_0805 = smd 1.2 x 1.2: A 0,-1.05; C 0,1.05
R0402 = smd 0.7 x 0.9: 1 -0.65,0; 2 0.65,0
TACTILE_SWITCH_SMD = smd 1.524 x 0.762: 1 -2.54,1.905; 2 2.54,1.905; 3 -2.54,-1.905; 4 2.54,-1.905
TP06R = smd 0.6 x 0.6: TP 0,0
UX60-MB-5ST = smd 2 x 0.5: 1 2.25,1.6; 2 2.25,0.8; 3 2.25,0; 4 2.25,-0.8; 5 2.25,-1.6 | smd 2.2 x 2.5: M1 -3.3,-4.2; M2 -3.3,4.2; M3 2,4.2; M4 2,-4.2
MICRO_SD_MOLEX = smd 0.8 x 1.8: 1 -10.54,16.7; 2 -9.44,16.7; 3 -8.34,16.7; 4 -7.24,16.7; 5 -6.14,16.7; 6 -5.04,16.7; 7 -3.94,16.7 | smd 0.8 x 1.292: 8 -2.84,16.929 | smd 1.7 x 3.4: CN@1 -16.15,15 | smd 1.7 x 3.6: CN@2 -16.15,5.625 | smd 1.7 x 2.2: CN@3 -15.45,0.8; CN@4 -0.85,1.8 | smd 1.55 x 2.1: CN@5 -0.775,6.4 | smd 1.55 x 2.8: CN@6 -0.775,14.1 | smd 1.6 x 1.55: CN@7 -12.64,16.125

### Placement (x,y rotation side)
C1  9.88,19.96 180 top
C2  4.26,8.18 0 top
C3  22.45,13.45 180 top
C4  38.84,14.93 180 bottom
C5  37.12,14.37 270 bottom
C6  27,14.59 0 bottom
C7  26.94,18.91 180 bottom
C8  29.04,18.22 270 bottom
C9  29.92,21.51 90 bottom
C10  30.38,23.86 90 bottom
C11  32.05,24.16 180 bottom
C12  31.49,21.21 180 bottom
C13  39.52,3.7 180 top
C14  30.86,3.86 180 top
C15  36.52,17.06 180 bottom
C16  36.52,16.06 180 bottom
C17  40.37,12.33 0 top
C18  27.45,16.94 90 top
C19  26.34,16.96 90 top
C20  12.4,0.62 180 top
C21  8.33,2.27 0 top
C22  8.38,1.06 0 top
C23  5.88,1.01 180 top
C24  5.85,2.27 180 top
C25  32.96,16.29 180 top
D1  6.95,21.2 180 bottom
IC11  42.86,19.57 180 bottom
IC12  6.33,10.23 90 top
IC13  0.08,11.17 270 top
IC14  21.28,16.79 270 bottom
IC15  22.49,15.95 270 top
IC16  48.68,15.62 180 bottom
IC21  48.13,32.4 270 bottom
IC22  27.02,16.79 90 bottom
IC23  32.56,17.08 270 bottom
IC24  29.47,8.39 315 bottom
IC25  22.2,4.74 180 top
IC31  13.07,4.35 90 top
IC32  6.82,5.49 180 top
IC33  22.14,5.57 270 bottom
IC34  39.23,7.62 0 bottom
IC35  20.8,11.74 180 bottom
IC36  13.71,10.66 180 top
IC37  14.31,19.04 90 bottom
JP1  13.04,21.81 0 top
JP2  48.59,1.64 90 top
JP3  18.12,1.49 0 top
JP4  9.38,21.16 90 top
JP5  10.81,21.16 90 top
L1  13.37,19.6 180 top
L2  35.63,17.18 270 top
L3  32.02,23.17 0 bottom
L4  31.62,22.17 0 bottom
L5  28.33,4.68 90 top
LED1  9.88,16.25 90 top
LED2  43.66,15.38 180 top
LED3  45.23,15.38 180 top
LED4  43.59,1.89 0 top
LED5  45.2,1.92 0 top
R1  8.54,13.47 270 top
R2  17.52,16.55 90 top
R3  47.37,15.19 180 top
R4  47.37,16.46 180 top
R5  19.6,18.96 180 bottom
R6  22.18,19.04 180 bottom
R7  35.34,13.76 180 bottom
R8  18.77,3.51 0 bottom
R9  17.06,4.21 270 top
R10  36.97,3.66 0 top
R11  36.09,19.55 90 bottom
R12  37.24,19.57 90 bottom
R13  38.39,19.57 90 bottom
R14  3.43,1.64 180 top
R15  43.51,4.91 90 top
R16  45.26,4.9 90 top
R17  27.01,14.69 0 top
S1  43.47,9.11 0 top
TP1  30.75,13.38 270 bottom
TP2  32.45,13.9 270 bottom
TP3  32.17,13.08 270 bottom
X1  4.56,17.47 0 top
X2  0.19,0.51 0 bottom

### Tracks (layer width: path | path; a pad name or v marks a point on that pad's centre or on a via)
!CS1  (via drill 0.3 pad 0.61)
  Top 0.15: v35.55,5.8 35.1,5.35 33,5.35 31.8,5.35 29.48,7.68 28.73,8.43 24.15,8.43 24.15,8.28 arc-90 23.4,7.53 23.25,7.53 22.35,7.53 21.45,8.43 20.18,8.43 19.5,8.43 arc-90 v19.12,8.8
  Bottom 0.15: v35.55,5.8 35.55,5.5 36.62,4.43 40.75,4.43 41.93,5.61 IC34.4 | v19.12,8.8 19.12,7.83 19.12,7.38 20.18,6.33 IC33.14
!CS2
  Bottom 0.15: IC35.7 20.8,14.65 18.38,14.65 18.38,9.25 18.38,7.53 20.03,5.88 20.08,5.82 IC33.13
!CS3
  Bottom 0.15: JP1.3 18,20.8 18,15.1 18,15.03 18,10.97 18,7.3 19.98,5.32 IC33.12
!CS4
  Bottom 0.15: IC33.11 19.88,4.82 17.55,7.15 17.55,15.4 17.55,15.47 17.55,20.05 17.33,20.2 16.89,20.5 JP1.2
!CS5  (via drill 0.3 pad 0.61)
  Top 0.15: v18,5.73 17.48,5.73 16.8,5.73 15,7.53 14.92,7.53 11.85,7.53 11.7,7.68 11.7,8.88 12.23,9.41 IC36.9
  Bottom 0.15: IC33.10 19.55,4.32 18.53,5.35 v18,5.73
+3V3  (via drill 0.3 pad 0.61)
  Top 0.15: 26.93,0.25 26.93,2.98 27.74,3.79 L5.1 | 17.62,0.25 24.53,0.25 | 24.53,0.25 26.93,0.25 | 17.62,0.25 18.12,0.74 JP3.1 17.06,2.4 R9.2 | 26.93,0.25 31.88,0.25 34.65,0.25 | 14.47,3.55 15.07,3.55 15.07,4.35 IC31.4 13.7,4.35 v13.65,4.3 | 14.47,3.55 14.34,3.55 IC31.3 14.4,2.24 14.4,1.15 14.32,1.07 | C20.1 13.88,0.62 14.32,1.07 | IC32.16 IC32.15 | IC32.5 IC32.4 8.67,6.55 7.65,6.55 7.65,5 | 7.65,5 7.65,4.51 IC32.1 9.82,4.53 9.82,3.55 14.47,3.55 | 17.62,0.25 15.15,0.25 14.32,1.07 | C22.2 8.97,2.23 C21.2 8.97,2.27 8.97,3.2 7.8,3.2 IC32.16 | 26.36,16.34 C18.1 27.45,16.38 28.12,16.38 28.12,18.54 28.59,19 33.83,19 34.27,19.45 34.27,19.82 34.73,20.27 35.48,20.27 35.91,19.84 35.91,18.07 L2.1 36.18,18.62 36.9,18.62 38.73,18.62 39.05,18.3 39.05,14.85 38.1,13.9 38.1,12.33 | 26.36,16.34 C19.1 26.34,14.69 | 26.36,16.34 26.16,16.14 | v25.73,13 26.34,13.54 26.34,14.69 | 34.65,0.25 37.05,0.25 | 37.05,0.25 42.62,0.25 43.22,0.84 LED4.A | LED4.A 44.95,0.84 LED5.A | v33.38,4.23 34.65,2.95 34.65,0.25 | v33.3,12.33 33.3,13.38 35.1,13.38 35.1,12.93 36.68,11.35 38.48,9.4 38.48,7.23 38.48,5.33 v38.24,5.09 37.65,4.51 36.96,4.51 36.68,4.22 36.68,4.02 R10.1 36.32,3.23 36.68,2.88 37.12,2.42 37.12,0.33 37.05,0.25 | 38.1,12.33 38.1,12.03 38.1,11.12 39.68,9.55 39.68,4.82 40.03,4.46 41.24,4.46 41.25,4.45 | 41.25,4.45 41.33,4.38 42.15,3.55 42.15,2.57 arc90 42.98,1.75 42.98,1.08 arc90 LED4.A | 26.34,14.69 R17.1 | R17.1 26.36,14.54 | 26.34,14.69 R17.1 | 24.53,0.25 24.53,2.12 v23.03,3.62 20.18,3.62 20.1,3.55 20.1,6.48 v21.08,7.45 | 38.1,12.33 C17.1 | 21.19,14.95 IC15.3 | 23.79,14.95 IC15.4 | v16.28,18.7 17.03,17.95 19.58,17.95 24.15,17.95 24.83,17.27 24.83,15.03 24.9,14.95
  Top 0.15: IC36.14 16.02,10.41 v16.35,10.08 | IC32.16 7.65,3.63 7.65,5 | 41.25,4.45 41.25,5.41 42.48,6.65 43.31,6.65 v43.42,6.75
  Top 0.305: 21.19,14.95 v22.58,14.95 22.58,15 IC15.4 23.84,14.24 C3.1 | 23.79,14.95 24.9,14.95 26.36,14.95 R17.1
  Bottom 0.15: v25.73,13 25.73,11.44 IC24.38 | IC24.17 33.38,4.49 v33.38,4.23 | IC24.5 31.87,11.5 32.7,11.5 33.3,12.1 v33.3,12.33 | IC33.6 24.23,4.82 24.23,3.85 23.03,3.85 v23.03,3.62 | IC33.16 21.82,7.45 v21.08,7.45 20.03,8.5 20.03,9.33 20.03,9.45 arc90 IC35.1 18.75,9.74 18.75,11.28 | IC35.6 18.75,13.74 18.75,11.28 | 18.75,11.28 19.74,11.28 IC35.3 | JP3.1 R8.2 | IC37.1 IC37.6 15.96,18.39 v16.28,18.7 | v22.58,14.95 IC14.3 | v16.35,10.08 16.35,9.25 15.67,8.58 15,7.9 15,5.12 14.17,4.3 v13.65,4.3 | v43.42,6.75 43.19,6.98 IC34.3 | IC34.6 IC34.5 37.16,5.09 v38.24,5.09
+5V  (via drill 0.3 pad 0.61)
  Top 0.15: LED1.A 11.03,16.15 11.03,15.18 | 14.32,20.52 16.55,20.52 16.58,20.5 23.78,20.5 25.12,21.85 42.52,21.85 43.5,20.88 45.98,20.88 46.05,20.8 v46.05,20.35 | R3.1 48.23,15.19 | R3.1 R4.1 | v48,13.9 48,15.19 R3.1
  Top 0.305: IC12.1 9.03,9.28 9.45,9.7 9.45,13.9 10.72,15.18 11.03,15.18 14.32,15.18 v14.4,15.25 | JP1.1 14.32,20.52 14.32,19.21 arc-90 L1.1 arc-90 14.32,18.94 v14.32,17.2
  Bottom 0.15: 46.02,20.32 v46.05,20.35 46.02,20.32 | 46.02,20.32 46.02,19.86 47.02,18.85 47.02,18.02 47.02,14.88 v48,13.9 | 46.02,20.32 IC11.19
  Bottom 0.305: v14.4,15.25 14.4,17.12 v14.32,17.2
<-RX  (via drill 0.3 pad 0.61)
  Top 0.15: v37.35,12.25 37.35,14.12 38.3,15.08 v38.3,16.07
  Bottom 0.15: IC24.10 33.38,9.47 36.15,12.25 v37.35,12.25 43.2,12.25 46.2,9.25 48.06,9.25 JP2.4 | IC11.2 39.92,18.32 arc90 39.6,18 39.6,17.5 38.68,16.57 38.3,16.2 v38.3,16.07
\SRST  (via drill 0.3 pad 0.61)
  Top 0.15: v32.25,12.18 32.25,13.83 35.48,13.83 35.62,13.68 35.62,12.93 37.05,11.5 39.08,9.47 39.08,4.23 38.92,4.07 C13.2 38.88,3.66 R10.2 37.8,3.48 37.8,1.82 38.13,1.49 JP3.9 38.44,1.71
  Bottom 0.15: IC24.4 31.84,12.18 v32.25,12.18 | IC16.3 48.68,14.22 49.8,13.15 49.8,0.68 49.33,0.25 39.68,0.25 JP3.9
AREF
  Bottom 0.15: JP3.2 20.66,2.23 21.15,2.73 23.1,2.73 23.77,3.4 24.68,3.4 24.68,4.3 IC24.29
AVCC  (via drill 0.3 pad 0.61)
  Top 0.15: v26.62,5.2 27,5.57 L5.2 29.58,5.57 30.25,4.9 C14.2
  Bottom 0.15: IC24.27 26.91,5.12 v26.62,5.2
AVDD
  Bottom 0.15: C8.2 29.04,17.33 IC23.29
BAT  (via drill 0.3 pad 0.61)
  Top 0.34: IC12.5 5.03,9.27 IC13.P$2_ | C2.1 3.33,8.5
  Top 0.406: v4.57,19.97 3.83,19.22 3.83,13.3 3.83,9.76 | 3.83,9.76 3.83,10.08 | 3.83,9.76 arc-90 IC13.P$2_ 3.33,8.5 C2.1 3.66,6.6 IC13.P$1_
  Bottom 0.406: JP5.BATT_+ 10.81,20.88 10.8,20.88 10.8,19.97 5.7,19.97 | D1.1 5.7,21.2 5.7,19.97 | v4.57,19.97 5.7,19.97
BAT_D
  Bottom 0.406: JP4.BATT_+ 9.38,21.2 D1.2
BAT_PWR  (via drill 0.3 pad 0.61)
  Top 0.305: v18.75,15.93 18.73,15.91 R2.1 17.52,15.06 16.95,14.43 11.1,14.43 10.42,13.75 10.42,12.93 10.65,12.7 v10.65,9.1 | IC13.P$3_ v3.68,3.92
  Bottom 0.305: IC14.4 19.67,15.93 v18.75,15.93 | v10.65,9.1 5.47,3.92 v3.68,3.92
CHARGE
  Top 0.15: IC12.3 8.12,11.18 8.54,11.61 R1.2
CLKM
  Bottom 0.15: IC23.17 34.31,14.14 R7.1
CS0
  Bottom 0.15: IC33.1 24.45,7.38 24.98,6.85 25.1,6.85 IC24.32
CS1
  Bottom 0.15: IC33.2 24.26,6.82 24.9,6.18 25.13,6.18 IC24.31
CS2
  Bottom 0.15: IC33.3 24.16,6.32 24.98,5.5 25.16,5.5 IC24.30
CS_SD  (via drill 0.3 pad 0.61)
  Top 0.15: IC36.8 11.32,10.41 v11.32,13.3
  Bottom 0.15: X2.2 arc90 9.6,17.17 9.6,15.93 9.6,15.03 v11.32,13.3
DEVDD  (via drill 0.3 pad 0.61)
  Top 0.15: v29.33,16.52 30.38,16.52 31.2,15.85 31.95,15.1 v35.93,15.1 | v35.93,15.1 35.91,15.12 35.91,16.29 L2.2 C25.1 | v35.93,15.1 35.93,15.3
  Bottom 0.15: IC23.15 35.69,15.83 C16.1 v35.92,15.11 v35.93,15.1 | IC23.28 29.48,16.83 v29.33,16.52
DIG2
  Bottom 0.15: R13.1 R12.1 37.27,18.92 37.27,18.32 IC23.10
DVDD
  Bottom 0.15: IC23.14 IC23.13 35.69,16.83 C15.1
DVSS
  Bottom 0.15: IC23.7 33.81,20.04 34.2,20.42 35.87,20.42 R11.2
FTDI_INTERNAL  (via drill 0.3 pad 0.61)
  Top 0.15: v41.33,16.3 43.35,18.32 v47.85,18.32
  Bottom 0.15: IC11.1 40.03,17.83 40.03,17.27 40.03,17.07 40.8,16.3 | C4.2 40.16,15.66 | 40.16,15.66 40.56,16.05 | IC11.16 46.73,21.87 47.1,21.49 47.1,19.6 47.85,18.85 v47.85,18.32 | 40.16,15.66 40.8,16.3 | 40.8,16.3 v41.33,16.3
FTDI_LED_RX  (via drill 0.3 pad 0.61)
  Top 0.15: LED3.C 45.23,13.75 v46.73,13.75
  Bottom 0.15: IC11.21 45.88,19.32 46.35,18.85 46.58,18.62 46.58,17.57 46.58,13.9 v46.73,13.75
FTDI_LED_TX  (via drill 0.3 pad 0.61)
  Top 0.15: v42.3,14.35 43.65,14.35 LED2.C
  Bottom 0.15: IC11.22 45.63,18.82 45.9,18.55 46.05,18.4 46.05,17.35 46.05,16.71 LED2.C 42.32,14.33 v42.3,14.35
FTDI_RESET  (via drill 0.3 pad 0.61)
  Top 0.15: v49.02,17.9 49.43,18.3 49.43,19.6 48.33,20.7 46.88,20.7 46.05,21.52 43.43,21.52 42.45,22.5 v39.98,22.5
  Bottom 0.15: v49.02,17.9 48.7,17.9 48.18,17.38 IC16.1 | IC11.11 42.11,22.37 42,22.47 40,22.47 v39.98,22.5
GND  (via drill 0.3 pad 0.61)
  Top 0.15: IC31.1 C20.2 11.5,0.33 7.77,0.33 | IC32.8 IC32.9 IC32.10 IC32.11 IC32.12 IC32.13 5.85,3.4 4.54,3.4 R14.2 2.77,0.33 5.25,0.33 | 7.77,0.33 C22.1 7.77,2.23 C21.1 | 5.25,0.33 7.77,0.33 | 5.25,0.33 5.25,1.01 C23.2 | 26.36,17.54 C18.2 | 26.36,17.54 C19.2 | v34.26,12.7 34.26,12.4 34.65,12.4 v36,11.12 | C13.1 40.98,2.84 JP3.10 | S1.1 40.9,11.05 | v38.85,11.5 39.34,11.02 S1.1 | C17.2 40.97,11.05 S1.1 | IC36.7 11.92,10.91 v11.92,11.72 | v22.12,5.58 24.15,5.58 arc90 24.23,5.65 24.23,6.85 24.38,7 25.65,7 28.08,7 v28.25,7.17 | v35.62,8.2 35.62,8.35 v31.88,8.35 | 26.36,17.54 25.31,17.54 25.24,17.54 24.23,18.55 24.23,18.7 24.9,19.38 25.73,20.2 v26.4,20.2 | v29.7,24.32 29.7,22.22 30,22.22 30.98,23.2 34.23,23.2 49.75,23.2 49.75,22.92 49.75,21 v49.5,20.75 | C14.1 32.24,3.86 v32.62,3.48 | C25.2 32.36,16.61 v33.08,17.33
  Top 0.2: 30,22.22 29.4,22.22 24.9,22.22 24,23.12 17.85,23.12 11.5,23.12 JP5.BATT_GND
  Top 0.305: v4.72,12.47 4.95,12.7 v4.95,15.18 | 6.3,8.5 v6.3,10.23 | C1.2 8.78,19.9 8.25,19.9 8.18,19.97 8.18,22.43 JP4.BATT_GND | IC15.2 19.88,15.95 19.88,13.6 21.3,12.18 21.83,12.18 | C3.2 21.85,12.18 21.83,12.18 | v29.4,10.83 26.55,10.83 24.9,12.47 23.33,12.47 v23.03,12.18 21.83,12.18
  Top 0.34: IC32.8 5.85,8.35 | 5.85,8.35 5.85,8.5 6.3,8.5 | v6.3,10.23 IC12.2 | C2.2 5.03,8.35 5.85,8.35
  Top 0.406: X1.5 6.81,15.18 v4.95,15.18 | v0.68,19.38 0.68,15.18 v2.85,15.18
  Bottom 0.15: IC23.TH 32.81,17.33 v33.08,17.33 | v33.08,17.33 33.38,17.33 | 33.38,17.33 33.75,17.33 | 33.75,17.33 33.9,17.33 | 33.9,17.33 IC23.12 | 33.75,17.33 33.75,16.22 | 33.75,16.22 33.75,14.73 IC23.18 33.81,13.69 33.98,13.53 33.98,12.99 v34.26,12.7 34.26,12.39 33.81,11.94 33,11.12 32.2,11.12 IC24.6 IC24.TH 29.47,9.31 30.39,9.31 31.88,9.31 v31.88,8.35 | IC23.16 34.65,15.33 arc-90 33.75,16.22 | 32.31,16.3 32.31,16.83 arc-90 IC23.TH | 32.31,16.3 IC23.21 | 31.81,18.1 IC23.3 | 31.81,18.1 31.81,17.83 arc90 IC23.TH | 31.31,18.6 IC23.2 | 31.31,18.6 arc90 31.81,18.1 | IC23.1 30.81,19.1 arc90 31.31,18.6 | 33.31,18.17 33.31,17.39 arc90 33.38,17.33 | 33.31,18.17 IC23.6 | 33.9,17.33 33.9,18.1 arc-90 34.63,18.83 IC23.9 34.91,18.9 R11.1 36.09,19.6 37.27,19.6 | 31.28,18.1 arc90 30.55,18.83 IC23.32 arc-90 30.2,18.82 29.55,18.82 | 31.28,18.25 31.28,18.56 arc-90 31.31,18.6 | 31.28,18.1 31.28,18.25 | IC23.31 31.2,18.33 arc-90 31.28,18.25 | IC23.30 31.01,17.83 arc90 31.28,18.1 | IC23.27 32.28,16.33 arc-90 32.31,16.3 | 29.55,18.82 C8.1 | 37.27,19.6 37.27,20.22 R12.2 37.24,20.88 33.83,20.88 33.3,20.35 33.3,19.38 | C5.1 C16.2 | C16.2 C15.2 38.4,17.05 39.15,17.8 39.15,18.32 39.15,19.32 39.21,19.32 | IC11.17 44.69,21.32 42.98,19.6 | 42.9,19.52 42.98,19.6 | 42.9,19.52 42.98,19.6 | 42.98,19.6 43.19,19.82 IC11.20 | IC11.24 44.98,17.82 arc-90 44.02,18.77 | 44.02,18.77 44.02,17.35 arc90 IC11.26 | 42.9,19.52 arc-90 42.69,19.32 IC11.4 39.21,19.32 | 37.27,19.6 38.93,19.6 39.21,19.32 | C6.1 27.67,14.59 IC22.4 IC22.2 26.37,18.91 C7.1 26.34,19.45 | 29.92,19.9 C9.1 29.92,21.21 C12.1 | 29.92,19.9 29.92,18.82 29.55,18.82 | v32.62,3.48 arc90 32.85,3.25
  Bottom 0.15: 44.02,18.77 44.02,19.6 42.98,19.6 | C4.1 37.13,16.05 C16.2 | v33.08,17.33 33.31,17.57 33.31,18.17 | IC33.4 IC33.5 22.39,5.32 22.12,5.32 v22.12,5.58 22.39,5.32 IC33.8 | 28.51,7.44 v28.25,7.17 | v36,11.12 36.38,11.5 v38.85,11.5 | IC35.11 20.78,11.34 | 20.78,11.34 20.78,11.28 20.78,10.54 IC35.2 | 20.78,11.34 20.78,12.14 IC35.4 IC35.5 | v11.92,11.72 10.95,11.72 10.65,11.72 8.18,14.2 | X2.6 5.23,18.55 2.33,18.55 2.17,18.4 2.17,17.42 2.17,16.67 2.48,16.38 2.7,16.15 2.85,16 2.85,15.47 | 8.18,14.2 7.72,14.65 | 8.18,14.2 7.2,15.18 7.05,15.18 v4.95,15.18 | IC37.2 14.32,19.04 14.32,20.35 11.7,20.35 11.7,22.45 10.81,22.45 JP5.BATT_GND | IC35.11 21.88,11.35 | IC35.11 22.73,11.34 23.03,11.34 v23.03,12.18 23.03,14.28 22.73,14.28 21.83,14.28 21.3,14.8 21.3,17.74 IC14.1 22.83,17.52 R6.2 | 36.5,8.2 IC34.7 36.37,8.43 36.15,8.2 v35.62,8.2 | 26.34,19.45 26.34,19.54 26.55,19.75 29.77,19.75 29.92,19.9 | v26.4,20.2 26.34,20.14 26.34,19.45 | C10.2 29.83,24.46 arc90 v29.7,24.32 | IC16.2 49.18,16.88 49.7,17.4 49.7,20.55 v49.5,20.75
  Bottom 0.2: C9.1 26.21,20.91 24,23.12 11.48,23.12 10.81,22.45 JP5.BATT_GND
  Bottom 0.305: JP3.10 40.98,3.15 40.88,3.25 32.85,3.25 v32.62,3.48 32.62,4.54 IC24.18 29.47,7.69 IC24.TH | IC24.TH 28.67,9.2 | 28.67,9.2 IC24.39 | IC24.TH 28.51,7.44 v28.25,7.17 IC24.28 | v6.3,10.23 4.72,11.8 v4.72,12.47 | v29.4,10.83 28.67,10.1 28.67,9.2
  Bottom 0.406: JP5.BATT_GND JP4.BATT_GND 0.68,22.43 0.68,20.2 v0.68,19.38 | 3.45,15.18 v2.85,15.18 | v4.95,15.18 3.45,15.18 | v2.85,15.18 2.85,15.47 | 3.45,15.18 v2.85,15.18 | C10.2 30.38,24.16 C11.1
  pour Top: 50.12,23.2 50.12,-0.2 -0.07,-0.12 -0.07,23.35 24,23.35 26.4,21.1 29.18,21.02 29.18,24.85 33.38,24.85 34.27,23.2
  pour Bottom: 50.12,23.2 50.12,-0.2 -0.15,-0.12 -0.15,23.35 24,23.35 26.4,21.1 29.18,21.02 29.18,24.85 33.38,24.85 34.27,23.12
I_MON
  Bottom 0.15: IC24.34 23.7,10.63 23.7,13.75 23.7,16.22 23.33,16.6 22.61,16.6 IC14.2
LED_CHARGE
  Top 0.15: R1.1 8.83,14.41 LED1.C
LED_RX
  Top 0.15: R4.2 46.69,16.43 LED3.A
LED_TX
  Top 0.15: R3.2 46.72,15.4 43.58,15.4 43.58,16.43 LED2.A
MSPI0  (via drill 0.3 pad 0.61)
  Top 0.15: IC36.12 14.21,8.65 16.05,8.65 17.55,10.15 20.25,10.15 21.15,10.15 22.28,9.03 v22.88,9.03 24.38,9.03 28.88,9.03 31.5,6.4 34.43,6.4 v34.65,6.33
  Bottom 0.15: IC35.14 20.8,9.03 v22.88,9.03 | IC24.13 34.37,6.33 v34.65,6.33 35.02,6.7 35.85,6.7 35.85,7.3 36.15,7.6 37.27,7.6 37.85,8.25 IC34.2 43.15,8.25 44.48,6.93 44.48,5.23 JP2.1
MSPI0_SD  (via drill 0.3 pad 0.61)
  Top 0.15: v13.71,8.14 IC36.11
  Bottom 0.15: X2.5 6.33,18.92 1.58,18.92 1.58,17.95 1.58,16.6 2.17,16 2.17,14.12 4.05,14.12 7.65,14.12 11.7,10.08 11.78,10 v13.71,8.14
MSPI1  (via drill 0.3 pad 0.61)
  Top 0.15: IC36.2 14.81,11.8 20.18,11.8 22.24,9.74 23.52,9.74 v23.55,9.78 arc90 23.85,9.47 29.25,9.47 30.68,8.05 31.35,7.38 v34.58,7.38
  Bottom 0.15: 41.93,9.25 41.55,8.88 41.48,8.8 36.3,8.8 36.08,8.8 35.93,8.95 35.33,8.95 35.02,8.65 34.58,8.12 v34.58,7.38 34.34,7.14 IC24.12 | 41.93,9.25 IC34.1 | IC35.13 22.16,9.78 v23.55,9.78 | 41.93,9.25 43.27,9.25 45.15,7.38 45.15,5.8 46.8,4.15 48.04,4.15 JP2.2
MSPI1_SD  (via drill 0.3 pad 0.61)
  Top 0.15: IC36.3 14.21,12.43 v14.85,13.08
  Bottom 0.15: X2.3 8.53,18.7 11.62,18.7 11.62,15.93 10.2,15.93 10.2,15.4 11.62,13.97 11.85,13.75 14.4,13.75 14.62,13.53 14.85,13.3 v14.85,13.08
MSPI2  (via drill 0.3 pad 0.61)
  Top 0.15: IC36.6 12.07,12.54 12.07,13.38 12.53,13.83 15.15,13.83 18.83,13.83 18.98,13.68 22.12,10.53 v22.95,10.53 24.6,10.53 25.05,10.08 29.33,10.08 30.23,9.18 v34.5,9.18
  Bottom 0.15: IC35.12 21.89,10.53 v22.95,10.53 | IC24.11 arc-90 33.79,9.18 v34.5,9.18 35.18,9.4 arc-27 IC34.8 36.82,9.25 40.8,9.25 40.8,9.33 arc-90 41.77,10.3 43.43,10.3 46.73,7 47.01,6.72 JP2.3
MSPI2_SD  (via drill 0.3 pad 0.61)
  Top 0.15: IC36.5 13.21,12.77 v12.9,13.08
  Bottom 0.15: 4.02,17.2 X2.7 4.05,15.93 7.72,15.93 7.72,15.85 11.03,12.55 11.55,12.55 12.6,12.55 12.9,12.85 v12.9,13.08
PA0
  Bottom 0.15: IC24.37 25.05,11.4 25.05,17.35 24.38,18.02 24.38,20.35 23.42,21.3 23.2,21.3 JP1.5
PA1
  Bottom 0.15: JP1.4 20.66,20.35 23.18,20.35 23.55,20.35 24,19.9 24,17.65 24.6,17.05 24.6,11.15 IC24.36
PB0  (via drill 0.3 pad 0.61)
  Top 0.15: v39.38,20.27 arc90 39,20.65 34.5,20.65 arc90 33.6,19.75 33.6,19.6 28.28,19.6 27.38,18.7 v25.2,18.7
  Bottom 0.15: v39.38,20.27 39.32,20.22 R13.2 | IC24.40 27.15,11.43 26.25,11.43 26.1,11.58 26.1,12.4 arc52 26.33,12.62 arc19 26.4,13.08 arc44 26.25,13.45 arc19 25.95,13.68 arc-35 25.5,14.12 25.5,18.02 25.2,18.32 v25.2,18.7
PB1  (via drill 0.3 pad 0.61)
  Top 0.15: v35.02,19.6 33.9,18.47 29.25,18.47 28.58,17.8 28.58,17.27 28.58,15.85 28.2,15.47 27,15.47 27,13.9 26.78,13.68 26.78,13.45 26.78,12.4 arc90 v26.93,12.25
  Bottom 0.15: IC24.41 27.15,12.13 v26.93,12.25 | IC23.8 34.86,19.43 v35.02,19.6
PB2  (via drill 0.3 pad 0.61)
  Top 0.15: R17.2 27.66,13.36 v27.53,13.22 27.68,13.08 29.4,13.08 31.43,11.05 34.73,11.05 arc-90 34.95,10.83 v34.95,10.08 | 40.88,7.26 S1.3 40.27,7.86 v40.27,10
  Bottom 0.15: IC24.42 27.53,12.54 v27.53,13.22 | v34.95,10.08 35.25,10.38 39.9,10.38 v40.27,10
PB3  (via drill 0.3 pad 0.61)
  Top 0.15: v38.18,17.88 37.2,17.88 37.2,15.25 36.15,14.2 31.73,14.2 30.23,15.7 29.55,15.7 29.18,15.33 29.18,13.9 v29.1,13.83
  Bottom 0.15: IC23.11 37.73,17.83 v38.18,17.88 | IC24.43 28.2,12.5 28.2,13.08 v29.1,13.83
PB4
  Bottom 0.15: IC23.23 31.31,14.31 arc-90 31.05,14.05 30.43,14.05 IC24.44
PB5
  Bottom 0.15: IC24.1 30.06,12.68 TP1.TP 31.05,13.38 31.8,14.12 31.8,14.72 IC23.22
PB6
  Bottom 0.15: IC23.20 32.81,14.26 TP2.TP 32.15,13.9 IC24.2
PB7
  Bottom 0.15: IC24.3 30.91,11.81 TP3.TP 32.62,13.08 33.3,13.75 33.3,14.72 IC23.19
PC0
  Top 0.15: JP3.8 arc90 JP3.8 35.9,2.23 34.12,4 34.12,4.53 33.75,4.9 33.08,4.9 31.65,4.9 28.95,7.6 28.5,8.05 27.98,8.05 27.45,7.53 24.38,7.53 23.62,7.08 23.48,7.08 22.28,7.08 21.9,7.45 21.3,8.05 20.33,8.05 19.28,7 18.75,7 18.68,6.93 18.68,4.9 18.64,4.86 R9.1 16.95,5.12 13.05,5.12 | IC32.2 8.67,5.12 13.05,5.12 | 13.05,5.12 13.05,6.4 IC31.6
  Bottom 0.15: IC24.19 31.8,4.65 31.8,3.32 32.33,2.8 34.5,2.8 35.8,1.49 JP3.8
PC1  (via drill 0.3 pad 0.61)
  Top 0.15: 11.8,5.81 IC31.7 | IC32.3 11.8,5.81 | 11.8,5.81 11.46,5.81 v10.42,6.85
  Bottom 0.15: IC24.20 31.35,4.4 31.35,3.25 33.11,1.49 JP3.7 33.38,1.47 33.38,0.62 33,0.25 20.18,0.25 20.03,0.25 arc-90 19.35,0.93 19.35,3.51 | 19.35,3.51 R8.1 | 19.35,3.51 19.35,3.77 18.83,4.3 17.55,4.3 17.4,4.15 17.4,3.62 17.33,3.55 13.72,3.55 12.38,3.55 10.42,5.5 v10.42,6.85
PC2
  Bottom 0.15: IC24.21 30.82,4.22 JP3.6
PC3
  Bottom 0.15: IC24.22 28.28,2.49 JP3.5
PC4
  Bottom 0.15: IC24.23 26.11,1.49 JP3.4
PC5
  Bottom 0.15: IC24.24 26.78,2.88 24.08,2.88 23.2,1.99 JP3.3
PC6  (via drill 0.3 pad 0.61)
  Top 0.15: IC25.4 v26.33,3.55
  Bottom 0.15: v26.33,3.55 26.75,3.55 IC24.25
PC7  (via drill 0.3 pad 0.61)
  Top 0.15: IC25.1 v25.95,4.45
  Bottom 0.15: v25.95,4.45 26.94,4.45 IC24.26
PD5  (via drill 0.3 pad 0.61)
  Top 0.15: R15.2 42.95,5.56 v42.23,4.83
  Bottom 0.15: IC24.14 32.88,7.04 34.88,5.05 35.33,5.05 35.62,4.75 35.62,4.3 35.85,4.08 41.85,4.08 42.23,4.45 v42.23,4.83
PD6  (via drill 0.3 pad 0.61)
  Top 0.15: v34.88,4.38 35.18,4.38 35.62,4.38 36.3,5.05 37.5,6.25 37.5,7.15 37.88,7.53 37.88,9.4 36.83,10.45 35.77,10.45 arc-90 35.33,10.9 arc90 34.8,11.43 31.73,11.43 29.85,13.3 v29.85,14.58
  Bottom 0.15: IC23.24 30.66,14.58 v29.85,14.58 | v34.88,4.38 32.53,6.72 IC24.15
PD7  (via drill 0.3 pad 0.61)
  Top 0.15: 45.08,5.5 R16.2 45.7,5.54 46.2,5.05 46.2,2.12 v46.43,1.9
  Bottom 0.15: IC24.16 32.25,6.4 34.12,4.53 34.12,4.15 34.58,3.7 41.48,3.7 43.27,1.9 v46.43,1.9
PLL
  Top 0.15: IC32.14 6.5,2.35 6.45,2.35 C24.1 6.46,1.01 C23.1
PLL_GND
  Top 0.15: R14.1 5.25,2.25 C24.2
PWR_MON  (via drill 0.3 pad 0.61)
  Top 0.305: R2.2 18.68,17.2 v18.75,17.27 19.12,16.9 IC15.1 22.5,16.9 22.5,15.93 23.84,15.93 IC15.5
  Bottom 0.15: R5.1 18.95,17.47 v18.75,17.27
  Bottom 0.305: IC14.5 19,17.52 v18.75,17.27
RF_XTAL1
  Bottom 0.15: C7.2 27.54,17.64 IC22.3 27.67,17.58 27.67,17.5 28.58,16.6 arc90 29.4,15.78 29.48,15.78 30.16,15.78 IC23.26
RF_XTAL2
  Bottom 0.15: IC22.1 26.37,14.59 C6.2 26.4,13.9 27.98,13.9 arc90 28.58,14.5 28.58,14.58 29.33,15.33 IC23.25
RFM
  Bottom 0.15: L3.1 32.93,22.86 32.93,19.97 32.81,19.86 IC23.5
  Bottom 0.406: C11.2 32.62,24.16 L3.1
RFM_ANT
  Bottom 0.406: IC21.RF_A 30.38,23.08 C10.1 31.42,23.26 L3.2
RFP
  Bottom 0.15: IC23.4 32.31,20.99 arc90 C12.2
  Bottom 0.406: L4.1 32.09,22.17 C12.2
RFP_ANT
  Bottom 0.406: IC21.RF_B 29.92,22.28 C9.2 31.02,22.11 L4.2
SD_EN  (via drill 0.3 pad 0.61)
  Top 0.15: v13.88,13.08 13.71,12.83 IC36.4 | IC36.1 15.83,10.91 v16.12,11.2 | IC36.13 15.38,9.41 v15.38,9.62 15.45,9.55 | IC36.10 13.21,8.88 arc-90 v12.53,8.2 | v23.48,8.28 22.2,8.28 21.68,8.8 20.4,8.8 19.65,9.55 18.9,9.55 17.93,9.55 17.03,8.65 v16.88,8.65
  Bottom 0.15: v15.38,9.62 15.38,9.7 v15.38,9.62 | v16.12,11.2 15.38,10.45 v15.38,9.62 | v12.53,8.2 13.28,7.45 13.95,7.45 14.4,7.9 14.4,8.65 v15.38,9.62 | v13.88,13.08 15.38,11.58 v15.38,9.62 | v16.12,11.2 16.12,12.85 15.07,13.9 15.07,17.5 15.75,17.72 17.03,17.72 17.03,19.69 IC37.4 | IC24.33 24.89,8.28 v23.48,8.28 | v16.88,8.65 17.1,8.72 17.1,11.12 17.03,11.2 v16.12,11.2
SD_PWR
  Bottom 0.15: X2.4 7.43,19.3 11.7,19.3 12.09,19.69 IC37.3
TX->
  Bottom 0.15: IC24.9 36.2,13 37.88,13 38.55,13 | 38.55,13 39,13 42.15,16.15 42.15,17.23 IC11.30 | JP2.5 45.23,11.79 44.02,13 38.55,13
USBDM  (via drill 0.3 pad 0.61)
  Top 0.15: X1.2 11.6,18.27 13.5,16.38 14.85,16.38 15.15,16.67 15.15,19.6 15.53,19.97 19.95,19.97 24.08,19.97 25.58,21.47 28.2,21.47 42.52,21.47 44.4,19.6 47.93,19.6 v47.93,20.05
  Bottom 0.15: IC11.15 44.11,22.31 44.33,22.52 47.85,22.52 48.38,22 48.38,20.5 v47.93,20.05
USBDP  (via drill 0.3 pad 0.61)
  Top 0.15: X1.3 11.65,17.47 13.2,15.93 15.15,15.93 15.6,16.38 15.6,19.15 15.9,19.45 16.05,19.45 24.08,19.45 24.38,19.45 25.8,20.88 26.03,21.1 35.77,21.1 42.52,21.1 44.7,18.92 48.75,18.92 v48.75,19.15
  Bottom 0.15: IC11.14 43.61,22.33 44.18,22.9 48.08,22.9 48.75,22.22 v48.75,19.15
USBPWR
  Top 0.34: X1.1 6.82,19.09
  Top 0.406: 6.82,19.09 6.84,19.07 12.55,19.07 L1.2 12.55,19.96 C1.1
USER_LED2
  Top 0.15: R16.1 44.98,4.19 45.2,3.96 LED5.C
USER_LED_1
  Top 0.15: R15.1 43.22,4.25 43.59,3.88 LED4.C
V_MON
  Bottom 0.15: IC24.35 24.08,10.96 24.08,13.83 24.08,16.82 23.55,17.35 23.55,19.6 23.25,19.9 23.18,19.9 21.53,19.9 R6.1 21.46,18.96 R5.2
XTAL1
  Bottom 0.15: C5.2 36.01,13.77 R7.2 36,13.5 IC24.8

### Text on the board
tFinish: ____ | 2011-08-08 | REV 1.2 | http://www.ibr.cs.tu-bs.de/projects/inga | U. Kulau, F. Büsching, L. Wolf | Ba | Li | - | 1 | + | JP1 | TX | RX | charge | SW1 | JP2 | JP3 | LED1 | LED2 | 1 | 1
bFinish: SerNo:________ | ID:___________